# EAGLE schematic BEP32_12nutzen_stencil (EAGLE 6.4), part 1 of 4

## Sheet 1 of 12
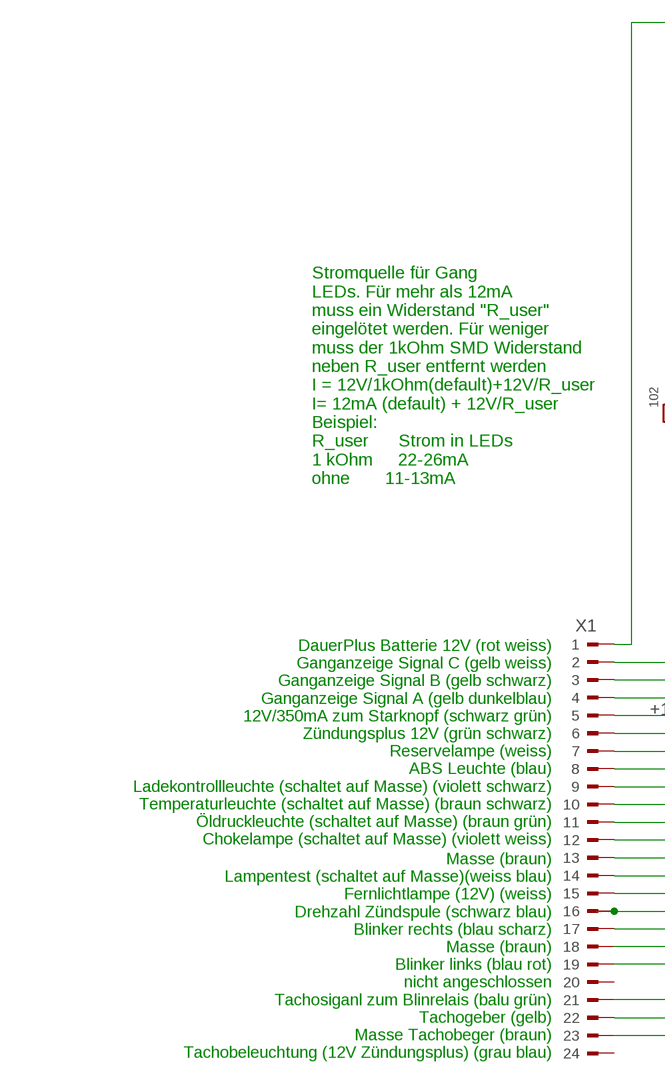
[diagram p0: schematic, sheet 1, part 1 of 2]
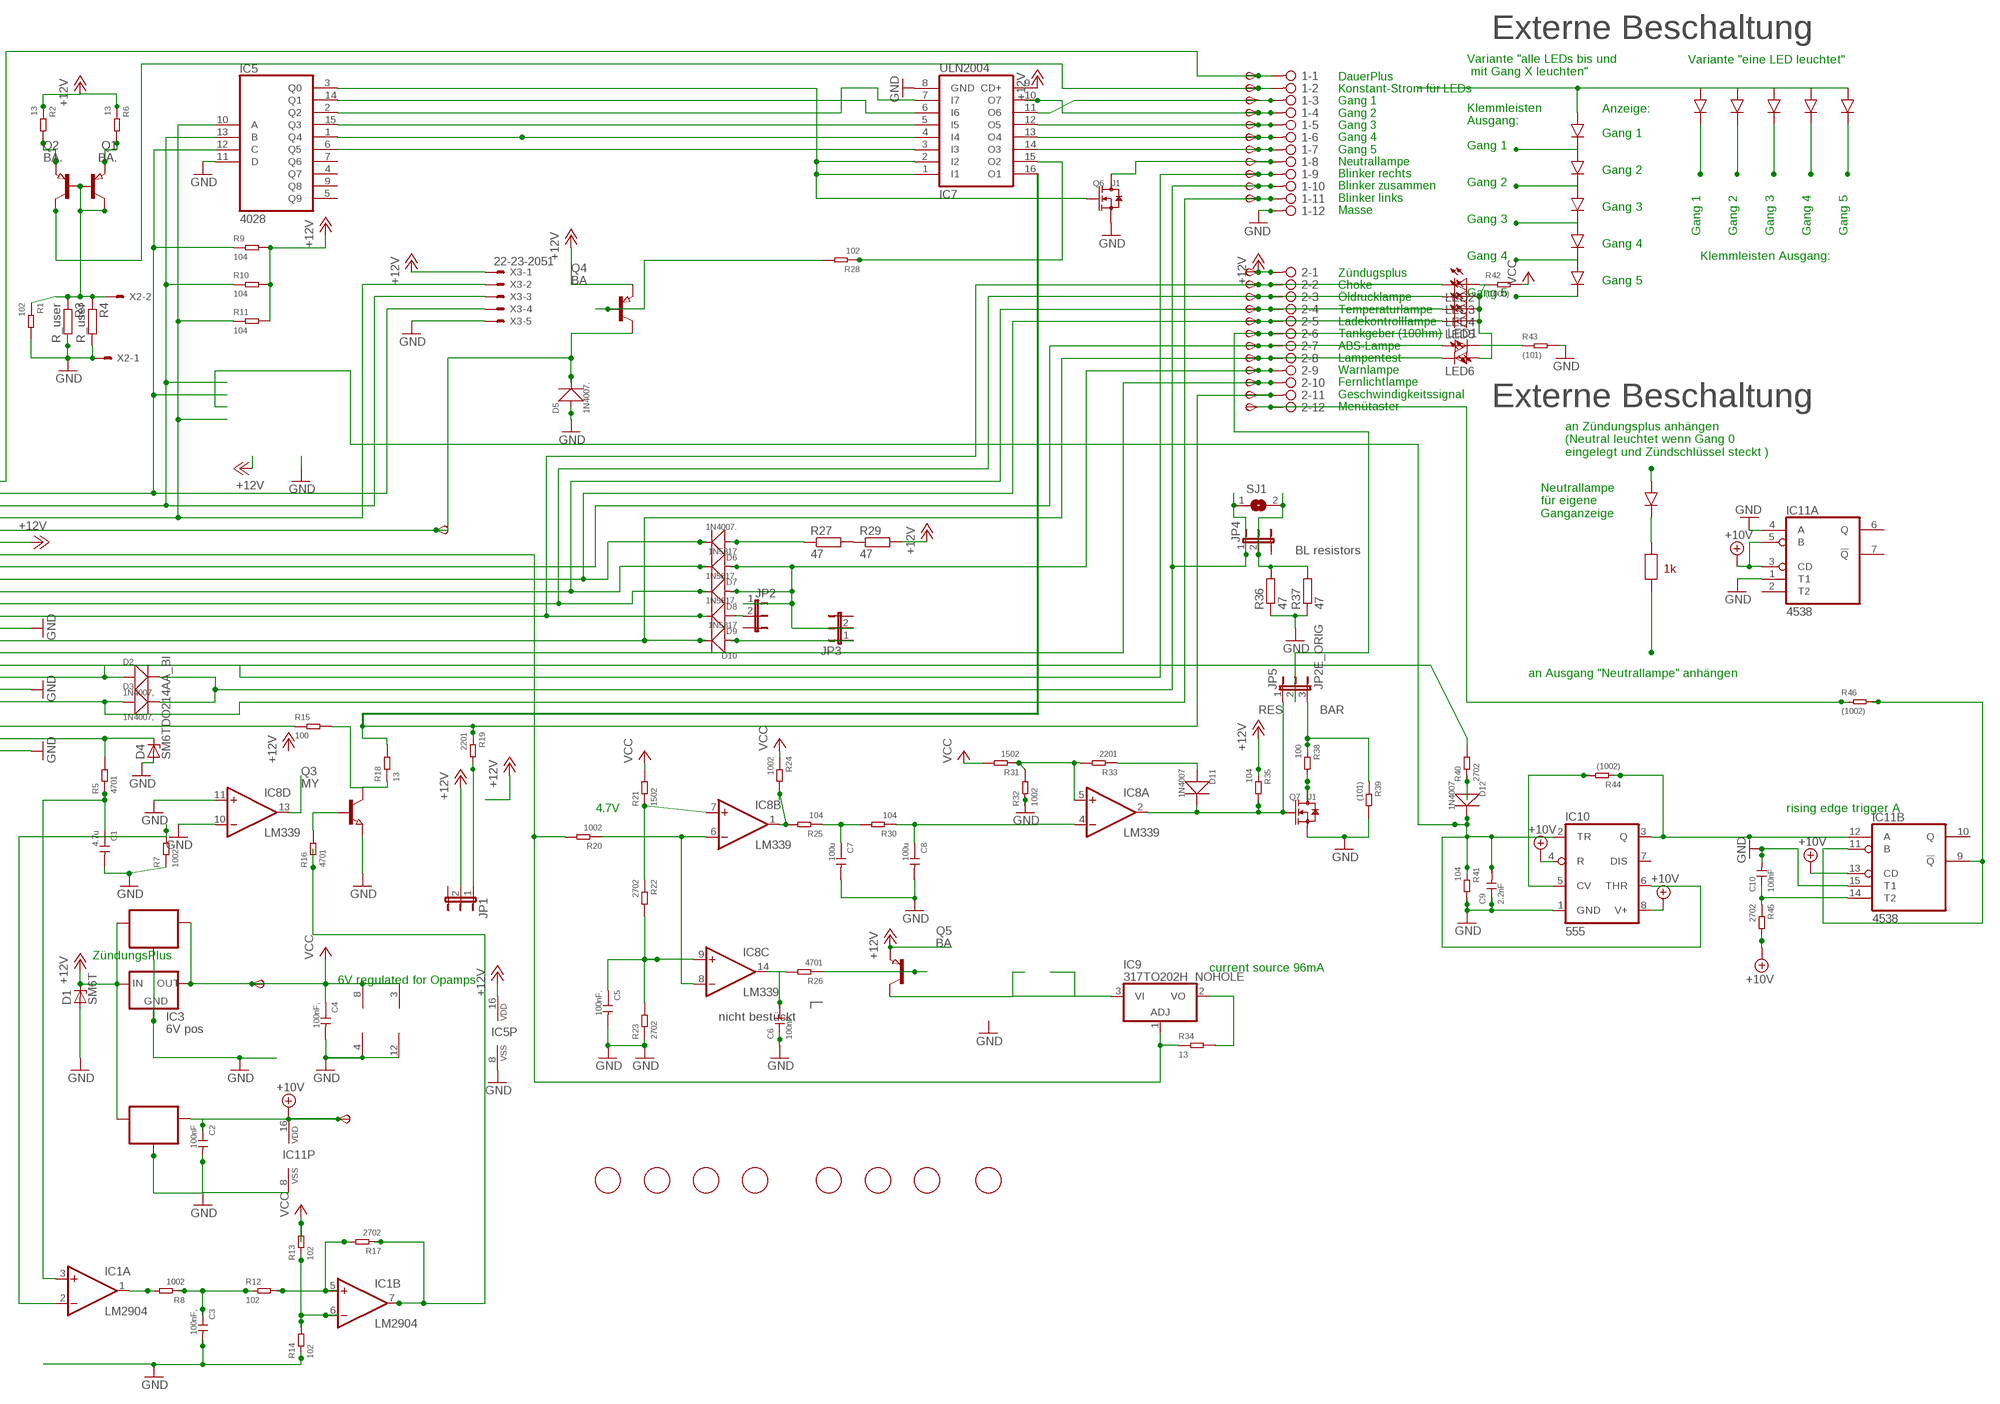
[diagram p1: schematic, sheet 1, part 2 of 2]

### Parts
1  2081-1132  [12-PIN]
2  2081-1132  [12-PIN]
6V  TPSB2.0  [B2.0]
10V  TPSB2.0  [B2.0]
C1  4.7u  CERAMIC-4.7UF-25V-10%-X5R(0805)  [C0805]
C2  100nF  CERAMIC-100NF-50V-10%-X7R(0805)  [C0805]
C3  100nF,  CERAMIC-100NF-50V-10%-X7R(0805)  [C0805]
C4  100nF,  CERAMIC-100NF-50V-10%-X7R(0805)  [C0805]
C5  100nF.  CERAMIC-100NF-50V-10%-X7R(0805)  [C0805]
C6  100nF.  CERAMIC-100NF-50V-10%-X7R(0805)  [C0805]
C7  100u  CERAMIC-100UF-6.3V-20%-X5R(1206)  [C1206]
C8  100u  CERAMIC-100UF-6.3V-20%-X5R(1206)  [C1206]
C9  2.2nF  CERAMIC-100NF-50V-10%-X7R(0805)  [C0805]
C10  100nF  CERAMIC-100NF-50V-10%-X7R(0805)  [C0805]
D1  SM6T  [DO214AA]
D2  1N4007,  DIODE-GEN-PURPOSE-1KV-1A(DO-214AC)  [DO-214AC]
D3  1N4007,  DIODE-GEN-PURPOSE-1KV-1A(DO-214AC)  [DO-214AC]
D4  SM6TDO214AA_BI  [DO214AA_BI]
D5  1N4007.  DIODE-GEN-PURPOSE-1KV-1A(DO-214AC)  [DO-214AC]
D6  1N4007.  DIODE-GEN-PURPOSE-1KV-1A(DO-214AC)  [DO-214AC]
D7  1N5817  DIODE-GEN-PURPOSE-1KV-1A(DO-214AC)DO-214AC/1206  [DO-214AC_SLIM]
D8  1N5817.  DIODE-GEN-PURPOSE-1KV-1A(DO-214AC)DO-214AC/1206  [DO-214AC_SLIM]
D9  1N5817.  DIODE-GEN-PURPOSE-1KV-1A(DO-214AC)DO-214AC/1206  [DO-214AC_SLIM]
D10  1N5817  DIODE-GEN-PURPOSE-1KV-1A(DO-214AC)DO-214AC/1206  [DO-214AC_SLIM]
D11  1N4007  DIODE-GEN-PURPOSE-1KV-1A(DO-214AC)  [DO-214AC]
D12  1N4007  DIODE-GEN-PURPOSE-1KV-1A(DO-214AC)  [DO-214AC]
FID1  FIDUCIAL  [FIDUCIAL_1MM]
FID2  FIDUCIAL  [FIDUCIAL_1MM]
FID3  FIDUCIAL  [FIDUCIAL_1MM]
FID4  FIDUCIAL  [FIDUCIAL_1MM]
FID49  FIDUCIAL  [FIDUCIAL_1MM]
FID50  FIDUCIAL  [FIDUCIAL_1MM]
FID51  FIDUCIAL  [FIDUCIAL_1MM]
FID52  FIDUCIAL  [FIDUCIAL_1MM]
IC1  LM2904  LM358D  [SO08]
IC2  78L06  78LXXSOT89_ROUND  [SOT89_ROUND]
IC3  6V pos  78LXX  [78LXX]
IC4  78L10  78LXXSOT89_ROUND  [SOT89_ROUND]
IC5  4028  4028D  [SO16]
IC7  ULN2004  ULN2004AD  [SO16]
IC8  LM339  LM339D  [SO14]
IC9  317TO202H_NOHOLE  [TO220H_NOHOLE]
IC10  555  NE555D  [SO08]
IC11  4538  4538D  [SO16]
JP1  JP2EJP2_SMALLPADS  [JP2_SMALLPADS]
JP2  JP2EJP2_SMALLPADS  [JP2_SMALLPADS]
JP3  JP2EJP2_SMALLPADS  [JP2_SMALLPADS]
JP4  JP2EJP2_SMALLPADS  [JP2_SMALLPADS]
JP5  JP2E_ORIG  [JP2_ORIG_SMALLPADS]
LED1  LEDLD260  [LD260]
LED2  LEDLD260  [LD260]
LED3  LEDLD260  [LD260]
LED4  LEDLD260  [LD260]
LED5  LEDLD260  [LD260]
LED6  LEDLD260  [LD260]
Q1  BA.  PNP-TRANSISTOR_SOT89  [SOT89]
Q2  BA.  PNP-TRANSISTOR_SOT89  [SOT89]
Q3  MY  NPN-TRANSISTOR_SOT89  [SOT89]
Q4  BA  PNP-TRANSISTOR_SOT89  [SOT89]
Q5  BA  PNP-TRANSISTOR_SOT89  [SOT89]
Q6  J1  SMD-MOSFET-N-CH-50V-200MA-BSS138W-7-F(SOT-23)  [SOT-23]
Q7  J1  SMD-MOSFET-N-CH-50V-200MA-BSS138W-7-F(SOT-23)  [SOT-23]
R1  102  SMD-RES-1K-5%-1/8W(0805)  [R0805]
R2  13  SMD-RES-13R-5%-1/4W(1206)  [R1206]
R3  R_user  R-EU_R0805  [R0805]
R4  R_user  R-EU_R0805  [R0805]
R5  4701  SMD-RES-4.7K-5%-1/8W(0805)  [R0805]
R6  13  SMD-RES-13R-5%-1/4W(1206)  [R1206]
R7  1002  SMD-RES-10K-1%-1/8W(0805)  [R0805]
R8  1002  SMD-RES-10K-1%-1/8W(0805)  [R0805]
R9  104  SMD-RES-10K-1%-1/8W(0805)  [R0805]
R10  104  SMD-RES-10K-1%-1/8W(0805)  [R0805]
R11  104  SMD-RES-10K-1%-1/8W(0805)  [R0805]
R12  102  SMD-RES-1K-5%-1/8W(0805)  [R0805]
R13  102  SMD-RES-1K-5%-1/8W(0805)  [R0805]
R14  102  SMD-RES-1K-5%-1/8W(0805)  [R0805]
R15  100  SMD-RES-220R-5%-1/8W(0805)  [R0805]
R16  4701  SMD-RES-4.7K-5%-1/8W(0805)  [R0805]
R17  2702  SMD-RES-4.7K-5%-1/8W(0805)  [R0805]
R18  13  SMD-RES-13R-5%-1/4W(1206)  [R1206]
R19  2201  SMD-RES-2.2K-5%-1/8W(0805)  [R0805]
R20  1002  SMD-RES-10K-1%-1/8W(0805)  [R0805]
R21  1502  SMD-RES-10K-1%-1/8W(0805)  [R0805]
R22  2702  SMD-RES-4.7K-5%-1/8W(0805)  [R0805]
R23  2702  SMD-RES-4.7K-5%-1/8W(0805)  [R0805]
R24  1002  SMD-RES-10K-1%-1/8W(0805)  [R0805]
R25  104  SMD-RES-10K-1%-1/8W(0805)  [R0805]
R26  4701  SMD-RES-4.7K-5%-1/8W(0805)  [R0805]
R27  47  R-EU_V235/17_1MM  [V235/17_1MM]
R28  102  SMD-RES-1K-5%-1/8W(0805)  [R0805]
R29  47  R-EU_V235/17_1MM  [V235/17_1MM]
R30  104  SMD-RES-10K-1%-1/8W(0805)  [R0805]
R31  1502  SMD-RES-10K-1%-1/8W(0805)  [R0805]
R32  1002  SMD-RES-10K-1%-1/8W(0805)  [R0805]
R33  2201  SMD-RES-2.2K-5%-1/8W(0805)  [R0805]
R34  13  SMD-RES-13R-5%-1/4W(1206)  [R1206]
R35  104  SMD-RES-10K-1%-1/8W(0805)  [R0805]
R36  47  R-EU_V235/17_1MM  [V235/17_1MM]
R37  47  R-EU_V235/17_1MM  [V235/17_1MM]
R38  100  SMD-RES-2.2K-5%-1/8W(0805)  [R0805]
R39  (101)  SMD-RES-2.2K-5%-1/8W(0805)  [R0805]
R40  2702  SMD-RES-10K-1%-1/8W(0805)  [R0805]
R41  104  SMD-RES-10K-1%-1/8W(0805)  [R0805]
R42  (1000)  SMD-RES-100R-5%-1/8W(0805)  [R0805]
R43  (101)  SMD-RES-100R-5%-1/8W(0805)  [R0805]
R44  (1002)  SMD-RES-10K-1%-1/8W(0805)  [R0805]
R45  2702  SMD-RES-4.7K-5%-1/8W(0805)  [R0805]
R46  (1002)  SMD-RES-4.7K-5%-1/8W(0805)  [R0805]
SJ1  SJ  [SJ]
START  TPSB2.0  [B2.0]
TP1  TPSB2.0  [B2.0]
TP2  TPSB2.0  [B2.0]
TP3  TPSB2.0  [B2.0]
TP4  TPSB2.0  [B2.0]
TP5  TPSB2.0  [B2.0]
TP6  TPSB2.0  [B2.0]
TP7  TPSB2.0  [B2.0]
TP8  TPSB2.0  [B2.0]
TP9  TPSB2.0  [B2.0]
TP10  TPSB2.0  [B2.0]
TP11  TPSB2.0  [B2.0]
TP12  TPSB2.0  [B2.0]
TP13  TPSB2.0  [B2.0]
TP16  TPSB2.0  [B2.0]
TP17  TPSB2.0  [B2.0]
TP18  TPSB2.0  [B2.0]
TP19  TPSB2.0  [B2.0]
TP21  TPSB2.0  [B2.0]
TP22  TPSB2.0  [B2.0]
TP23  TPSB2.0  [B2.0]
TP24  TPSB1,27  [B1,27]
TP25  TPSB2.0  [B2.0]
TP26  TPSB2.0  [B2.0]
X1  CON_BMWV2  [24-PIN_V2]
X2  22-23-2021  [22-23-2021]
X3  22-23-2051  [22-23-2051]

### Nets
+10V: 10V.TP(PP) C2.1 IC4.1(OUT) IC10.4(R) IC10.8(V+) IC11.3(A:CD) IC11.5(A:B) IC11.13(B:CD) IC11.16(P:VDD) R45.2 ; also sheet 2,3,4,5,6,7,8,9,10,11,12
+12V: 2.1 D1.C IC2.3(IN) IC3.IN IC4.3(IN) IC5.16(VDD) IC7.9(CD+) JP1.2 Q4.3(E) Q5.3(E) R2.1 R6.1 R9.2 R10.2 R11.2 R29.2 R35.1 TP12.TP(PP) X1.6 X3.1 ; also sheet 2,3,4,5,6,7,8,9,10,11,12
+12V1: IC1.7(B:OUT) R16.1 R17.1
GND: 1.12 C1.2 C2.2 C3.2 C4.2 C5.2 C6.1 C7.2 C8.2 C9.1 C10.2 D1.A D4.A D5.1(+) IC1.4(P:V-) IC2.2(GND) IC2.2@1(GND) IC3.GND IC4.2(GND) IC4.2@1(GND) IC5.8(VSS) IC5.11(D) IC7.8(GND) IC8.10(D:-IN) IC8.11(D:+IN) IC8.12(P:GND) IC10.1(GND) IC11.1(A:T1) IC11.4(A:A) IC11.8(P:VSS) IC11.15(B:T1) Q3.3(E) Q6.2(S) Q7.2(S) R1.2 R3.2 R4.2 R7.1 R14.1 R23.1 R32.1 R36.1 R37.1 R39.2 R41.2 R43.2 X1.13 X1.18 X1.23 X2.1 X3.5 ; also sheet 2,3,4,5,6,7,8,9,10,11,12
N$1: 2.9 D7.1(+) D8.1(+) JP2.1 JP3.2 TP24.TP(PP)
N$2: IC5.10(A) R11.1 X1.4 X3.2
N$3: IC5.13(B) R10.1 X1.3 X3.3
N$4: 2.7 LED1.A TP22.TP(PP) X1.8
N$5: Q1.3(E) R2.2
N$6: D11.2(-) IC8.2(A:OUT) JP5.1 Q7.1(G) R35.2
N$7: IC1.2(A:-IN) R7.2
N$8: R27.2 R29.1
N$9: Q2.3(E) R6.2
N$11: D5.2(-) Q4.2(C) START.TP(PP) X1.5
N$12: 2.2 D9.2(-) LED2.K(C) TP16.TP(PP) X1.12
N$13: 2.3 D8.2(-) LED3.K(C) TP17.TP(PP) X1.11
N$14: 2.4 D7.2(-) LED4.K(C) TP18.TP(PP) X1.10
N$15: IC9.3(VI) Q5.2(C)
N$16: IC8.6(B:-IN) IC8.8(C:-IN) R20.1
N$17: IC5.12(C) R9.1 X1.2 X3.4
N$18: IC5.15(Q3) IC7.5(I5)
N$19: 2.8 D10.2(-) LED6.K(C) TP23.TP(PP) X1.14
N$20: 1.9 D2.1(+) TP9.TP(PP) X1.17
N$21: 1.11 D3.1(+) TP11.TP(PP) X1.19
N$22: IC11.9(B:!Q) IC11.11(B:B) R46.2
N$23: D4.C R5.2 X1.22
N$24: C1.1 IC1.3(A:+IN) R5.1
N$25: 1.6 IC7.13(O4) TP6.TP(PP)
N$26: 1.7 IC7.14(O3) TP7.TP(PP)
N$27: 2.11 IC7.16(O1) R18.2 R19.1 TP26.TP(PP)
N$28: 2.6 JP5.2 TP21.TP(PP)
N$29: JP1.1 R19.2
N$30: C5.1 IC8.9(C:+IN) R22.2 R23.2
N$31: C6.2 IC8.14(C:OUT) R26.2
N$32: C9.2 D12.2(-) IC10.2(TR) IC10.6(THR) R41.1
N$34: LED1.K(C) R43.1
N$35: IC9.1(ADJ) R20.2 R34.1 X1.7
N$36: Q5.1(B) R26.1
N$37: IC5.2(Q2) IC7.7(I7)
N$38: 1.3 IC7.11(O6) TP3.TP(PP)
N$39: 1.5 IC7.12(O5) TP5.TP(PP)
N$41: LED2.A LED3.A LED4.A LED5.A LED6.A R42.1
N$42: R40.2 X1.16
N$43: Q4.1(B) R28.2
N$44: IC5.3(Q0) IC7.1(I1) IC7.2(I2) Q6.1(G)
N$45: C7.1 R25.1 R30.2
N$46: C8.1 IC8.4(A:-IN) R30.1
N$47: IC8.5(A:+IN) R31.1 R32.2 R33.2
N$48: Q7.3(D) R38.2
N$49: D11.1(+) R33.1
N$50: IC5.1(Q4) IC7.4(I4)
N$51: R15.1 X1.21
N$52: 1.8 Q6.3(D) TP8.TP(PP)
N$53: 2.10 TP25.TP(PP) X1.15
N$54: D6.1(+) R27.1
N$55: 2.5 D6.2(-) LED5.K(C) TP19.TP(PP) X1.9
N$56: IC5.14(Q1) IC7.6(I6)
N$57: Q1.1(B) Q2.1(B) Q2.2(C) R1.1 R3.1 R4.1 X2.2
N$58: Q3.2(C) R15.2 R18.1
N$59: 1.2 Q1.2(C) TP2.TP(PP)
N$60: IC8.13(D:OUT)
N$61: IC5.6(Q5) IC7.3(I3)
N$64: IC9.2(VO) R34.2
N$65: IC10.5(CV) R44.2
N$67: 1.4 IC7.10(O7) TP4.TP(PP)
N$69: 1.1 TP1.TP(PP) X1.1
N$83: IC8.7(B:+IN) R21.1 R22.1
N$85: Q3.1(B) R16.2
N$86: IC10.3(Q) IC11.12(B:A) R44.1
N$87: D12.1(+) R40.1
N$88: IC7.15(O2) R28.1
N$89: C10.1 IC11.14(B:T2) R45.1
N$90: 2.12 R46.1 TP13.TP(PP)
N$92: IC1.1(A:OUT) R8.2
N$93: 1.10 D2.2(-) D3.2(-) JP4.1 SJ1.1 TP10.TP(PP)
N$94: JP4.2 R36.2 R37.2 SJ1.2
N$95: D9.1(+) JP2.2
N$96: C3.1 R8.1 R12.1
N$97: IC1.5(B:+IN) R12.2 R17.2
N$98: D10.1(+) JP3.1
N$99: JP5.3 R38.1 R39.1
N$101: IC1.6(B:-IN) R13.1 R14.2
N$580: IC8.1(B:OUT) R24.2 R25.2
VCC: 6V.TP(PP) C4.1 IC1.8(P:V+) IC2.1(OUT) IC3.OUT IC8.3(P:V+) R13.2 R21.2 R24.1 R31.2 R42.2 ; also sheet 2,3,4,5,6,7,8,9,10,11,12
Unconnected: IC5.4(Q7) IC5.5(Q9) IC5.7(Q6) IC5.9(Q8) IC10.7(DIS) IC11.2(A:T2) IC11.6(A:Q) IC11.7(A:!Q) IC11.10(B:Q) X1.20 X1.24

### Notes on the sheet
- Externe Beschaltung
- Variante "eine LED leuchtet"
- Variante "alle LEDs bis und
   mit Gang X leuchten"
- Anzeige:
- Klemmleisten
  Ausgang:
- Gang 1
- DauerPlus
  Konstant-Strom für LEDs
  Gang 1
  Gang 2
  Gang 3
  Gang 4
  Gang 5
  Neutrallampe
  Blinker rechts
  Blinker zusammen
  Blinker links
  Masse
- Gang 1
- Gang 2
- Gang 2
- Gang 3
- Gang 3
- Gang 1 | Gang 2 | Gang 3 | Gang 4 | Gang 5
- Gang 4
- Gang 4 | Klemmleisten Ausgang:
- Gang 5
- Gang 5
- Zündugsplus
  Choke
  Öldrucklampe
  Temperaturlampe
  Ladekontrolllampe
  Tankgeber (100hm)
  ABS-Lampe
  Lampentest
  Warnlampe
  Fernlichtlampe
  Geschwindigkeitssignal
  Menütaster
- Stromquelle für Gang
  LEDs. Für mehr als 12mA
  muss ein Widerstand "R_user"
  eingelötet werden. Für weniger
  muss der 1kOhm SMD Widerstand
  neben R_user entfernt werden
  I = 12V/1kOhm(default)+12V/R_user
  I= 12mA (default) + 12V/R_user
  Beispiel:
  R_user      Strom in LEDs
  1 kOhm     22-26mA
  ohne       11-13mA
- Externe Beschaltung
- an Zündungsplus anhängen
  (Neutral leuchtet wenn Gang 0
  eingelegt und Zündschlüssel steckt )
- Neutrallampe
  für eigene
  Ganganzeige
- DauerPlus Batterie 12V (rot weiss)
  Ganganzeige Signal C (gelb weiss)
  Ganganzeige Signal B (gelb schwarz)
  Ganganzeige Signal A (gelb dunkelblau)
  12V/350mA zum Starknopf (schwarz grün)
  Zündungsplus 12V (grün schwarz)
  Reservelampe (weiss)
  ABS Leuchte (blau)
  Ladekontrollleuchte (schaltet auf Masse) (violett schwarz)
  Temperaturleuchte (schaltet auf Masse) (braun schwarz)
  Öldruckleuchte (schaltet auf Masse) (braun grün)
  Chokelampe (schaltet auf Masse) (violett weiss)
- BL resistors
- 1k
- an Ausgang "Neutrallampe" anhängen
- Masse (braun)
  Lampentest (schaltet auf Masse)(weiss blau)
  Fernlichtlampe (12V) (weiss)
  Drehzahl Zündspule (schwarz blau)
  Blinker rechts (blau scharz)
  Masse (braun)
  Blinker links (blau rot)
  nicht angeschlossen
  Tachosiganl zum Blinrelais (balu grün)
  Tachogeber (gelb)
  Masse Tachobeger (braun)
  Tachobeleuchtung (12V Zündungsplus) (grau blau)
- RES | BAR
- 4.7V | rising edge trigger A
- ZündungsPlus
- current source 96mA
- 6V regulated for Opamps
- nicht bestückt

## Sheet 2 of 12
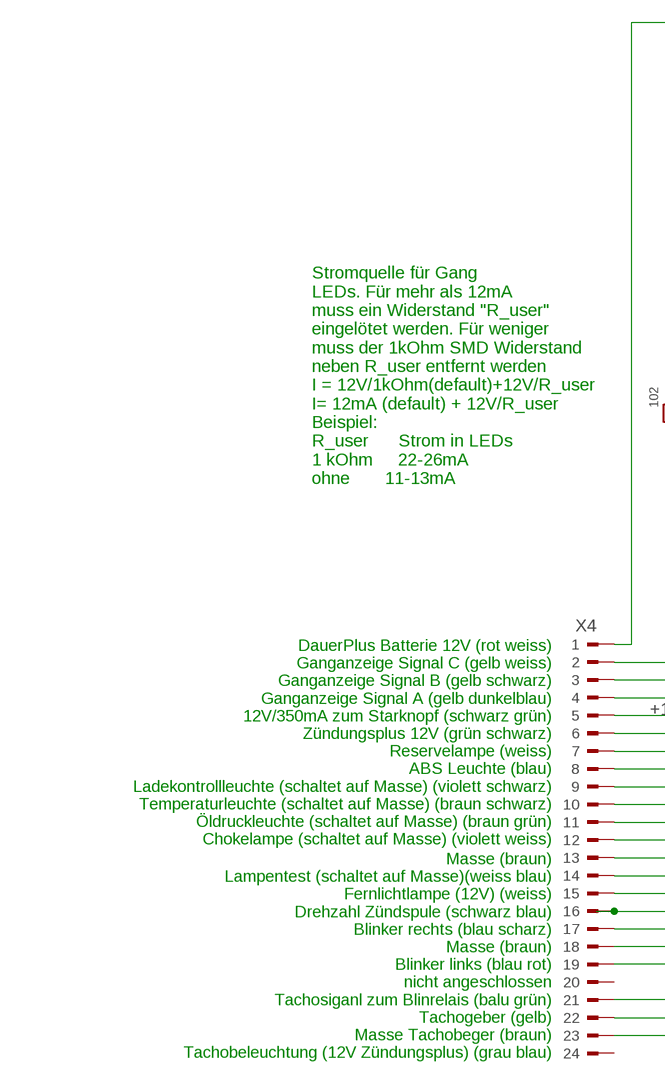
[diagram p2: schematic, sheet 2, part 1 of 2]
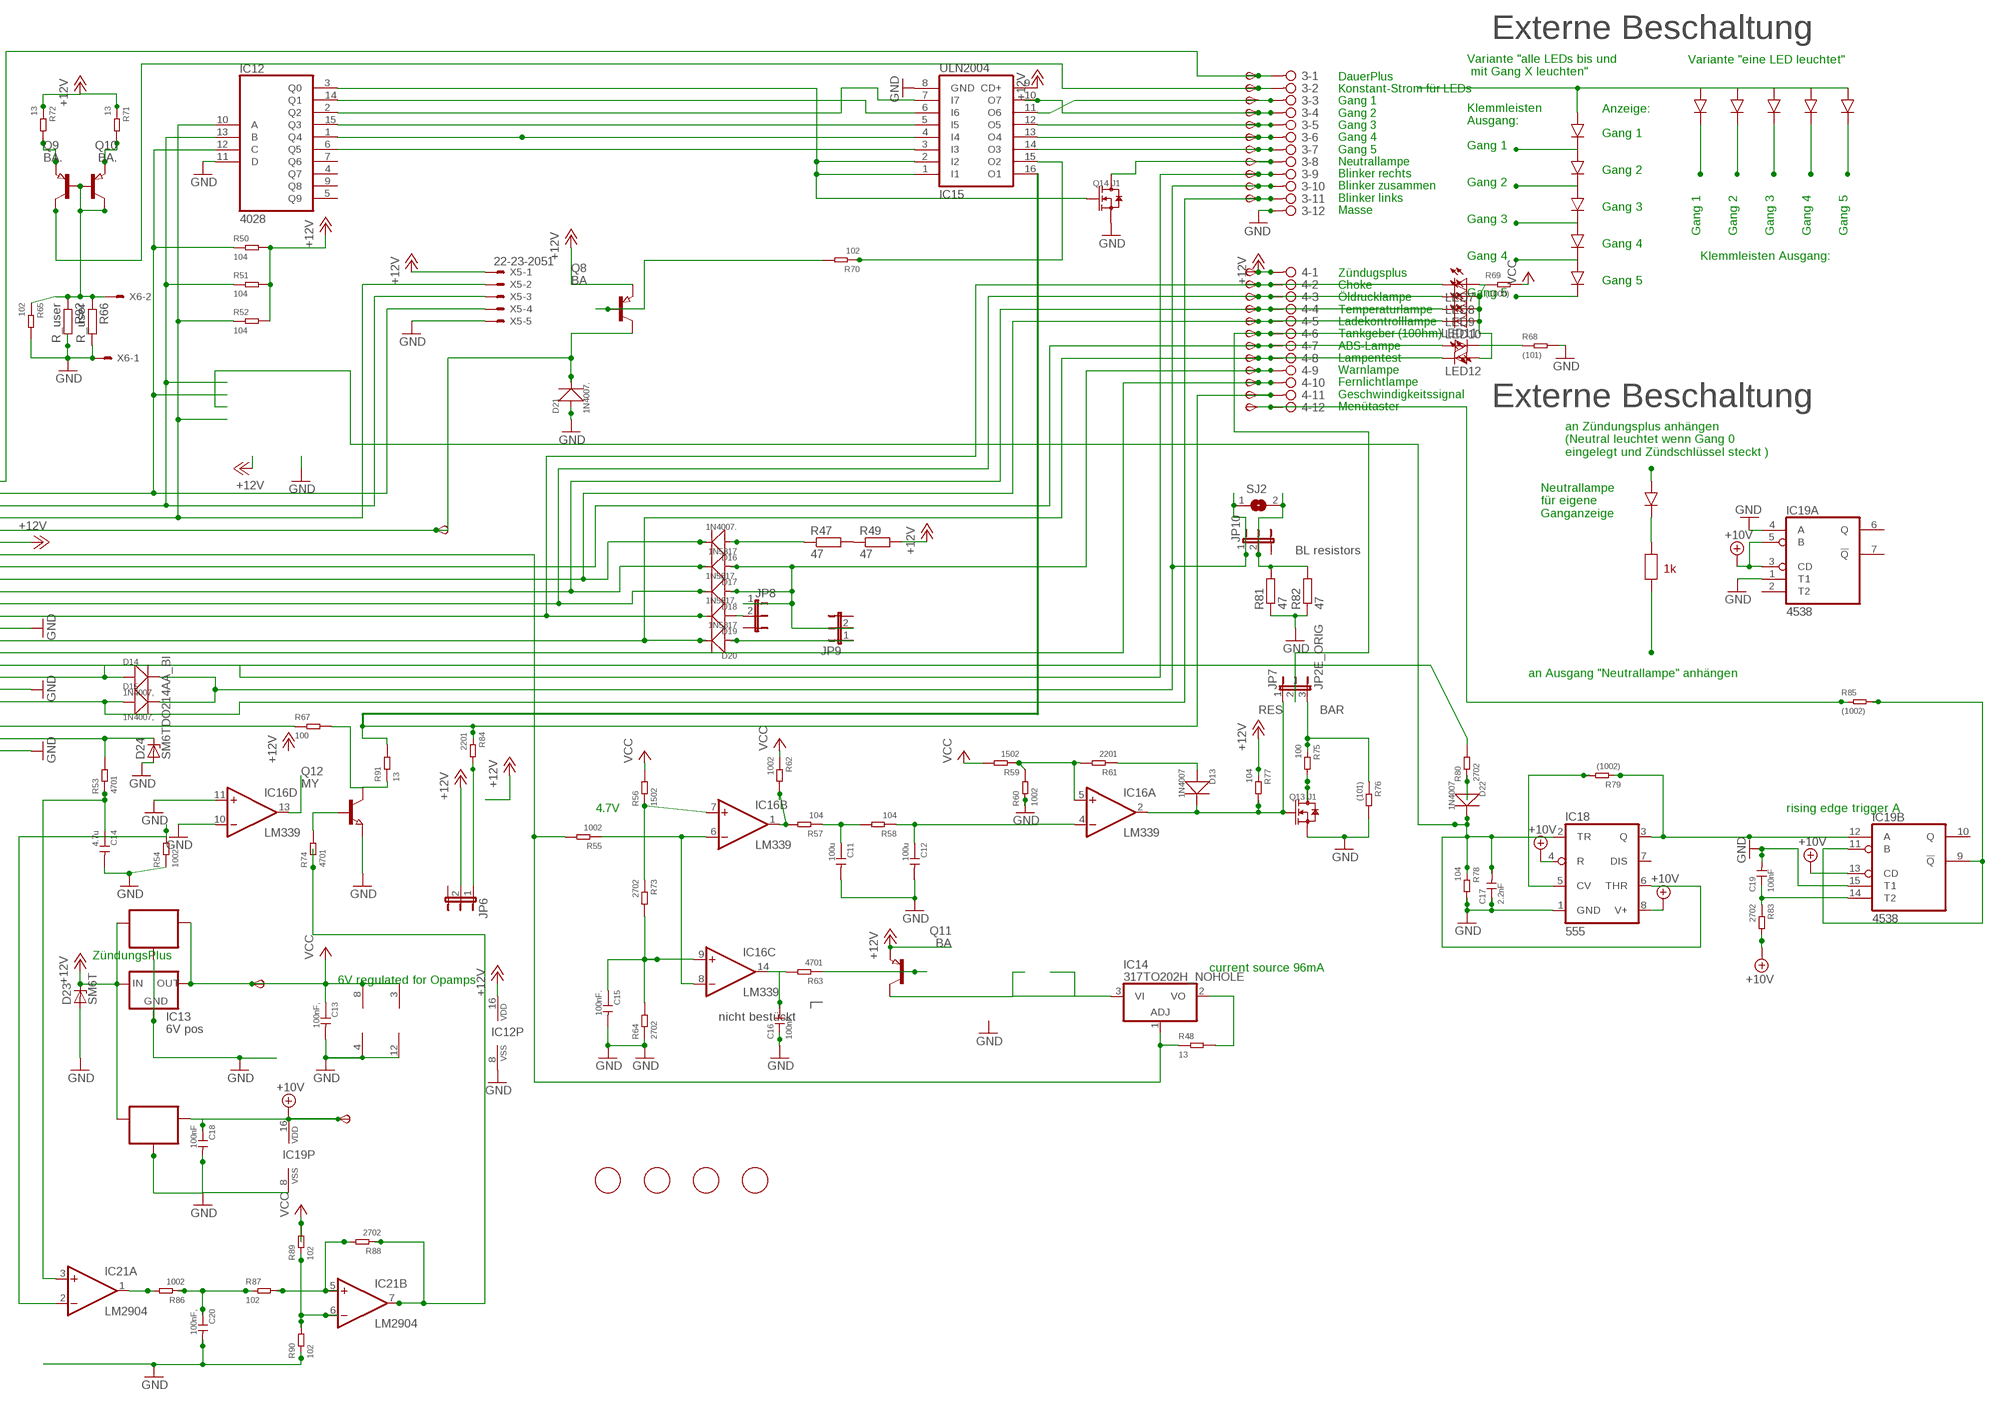
[diagram p3: schematic, sheet 2, part 2 of 2]

### Parts
3  2081-1132  [12-PIN]
4  2081-1132  [12-PIN]
6V1  TPSB2.0  [B2.0]
10V1  TPSB2.0  [B2.0]
C11  100u  CERAMIC-100UF-6.3V-20%-X5R(1206)  [C1206]
C12  100u  CERAMIC-100UF-6.3V-20%-X5R(1206)  [C1206]
C13  100nF,  CERAMIC-100NF-50V-10%-X7R(0805)  [C0805]
C14  4.7u  CERAMIC-4.7UF-25V-10%-X5R(0805)  [C0805]
C15  100nF.  CERAMIC-100NF-50V-10%-X7R(0805)  [C0805]
C16  100nF.  CERAMIC-100NF-50V-10%-X7R(0805)  [C0805]
C17  2.2nF  CERAMIC-100NF-50V-10%-X7R(0805)  [C0805]
C18  100nF  CERAMIC-100NF-50V-10%-X7R(0805)  [C0805]
C19  100nF  CERAMIC-100NF-50V-10%-X7R(0805)  [C0805]
C20  100nF,  CERAMIC-100NF-50V-10%-X7R(0805)  [C0805]
D13  1N4007  DIODE-GEN-PURPOSE-1KV-1A(DO-214AC)  [DO-214AC]
D14  1N4007,  DIODE-GEN-PURPOSE-1KV-1A(DO-214AC)  [DO-214AC]
D15  1N4007,  DIODE-GEN-PURPOSE-1KV-1A(DO-214AC)  [DO-214AC]
D16  1N4007.  DIODE-GEN-PURPOSE-1KV-1A(DO-214AC)  [DO-214AC]
D17  1N5817  DIODE-GEN-PURPOSE-1KV-1A(DO-214AC)DO-214AC/1206  [DO-214AC_SLIM]
D18  1N5817.  DIODE-GEN-PURPOSE-1KV-1A(DO-214AC)DO-214AC/1206  [DO-214AC_SLIM]
D19  1N5817.  DIODE-GEN-PURPOSE-1KV-1A(DO-214AC)DO-214AC/1206  [DO-214AC_SLIM]
D20  1N5817  DIODE-GEN-PURPOSE-1KV-1A(DO-214AC)DO-214AC/1206  [DO-214AC_SLIM]
D21  1N4007.  DIODE-GEN-PURPOSE-1KV-1A(DO-214AC)  [DO-214AC]
D22  1N4007  DIODE-GEN-PURPOSE-1KV-1A(DO-214AC)  [DO-214AC]
D23  SM6T  [DO214AA]
D24  SM6TDO214AA_BI  [DO214AA_BI]
FID5  FIDUCIAL  [FIDUCIAL_1MM]
FID6  FIDUCIAL  [FIDUCIAL_1MM]
FID7  FIDUCIAL  [FIDUCIAL_1MM]
FID8  FIDUCIAL  [FIDUCIAL_1MM]
IC12  4028  4028D  [SO16]
IC13  6V pos  78LXX  [78LXX]
IC14  317TO202H_NOHOLE  [TO220H_NOHOLE]
IC15  ULN2004  ULN2004AD  [SO16]
IC16  LM339  LM339D  [SO14]
IC17  78L06  78LXXSOT89_ROUND  [SOT89_ROUND]
IC18  555  NE555D  [SO08]
IC19  4538  4538D  [SO16]
IC20  78L10  78LXXSOT89_ROUND  [SOT89_ROUND]
IC21  LM2904  LM358D  [SO08]
JP6  JP2EJP2_SMALLPADS  [JP2_SMALLPADS]
JP7  JP2E_ORIG  [JP2_ORIG_SMALLPADS]
JP8  JP2EJP2_SMALLPADS  [JP2_SMALLPADS]
JP9  JP2EJP2_SMALLPADS  [JP2_SMALLPADS]
JP10  JP2EJP2_SMALLPADS  [JP2_SMALLPADS]
LED7  LEDLD260  [LD260]
LED8  LEDLD260  [LD260]
LED9  LEDLD260  [LD260]
LED10  LEDLD260  [LD260]
LED11  LEDLD260  [LD260]
LED12  LEDLD260  [LD260]
Q8  BA  PNP-TRANSISTOR_SOT89  [SOT89]
Q9  BA.  PNP-TRANSISTOR_SOT89  [SOT89]
Q10  BA.  PNP-TRANSISTOR_SOT89  [SOT89]
Q11  BA  PNP-TRANSISTOR_SOT89  [SOT89]
Q12  MY  NPN-TRANSISTOR_SOT89  [SOT89]
Q13  J1  SMD-MOSFET-N-CH-50V-200MA-BSS138W-7-F(SOT-23)  [SOT-23]
Q14  J1  SMD-MOSFET-N-CH-50V-200MA-BSS138W-7-F(SOT-23)  [SOT-23]
R47  47  R-EU_V235/17_1MM  [V235/17_1MM]
R48  13  SMD-RES-13R-5%-1/4W(1206)  [R1206]
R49  47  R-EU_V235/17_1MM  [V235/17_1MM]
R50  104  SMD-RES-10K-1%-1/8W(0805)  [R0805]
R51  104  SMD-RES-10K-1%-1/8W(0805)  [R0805]
R52  104  SMD-RES-10K-1%-1/8W(0805)  [R0805]
R53  4701  SMD-RES-4.7K-5%-1/8W(0805)  [R0805]
R54  1002  SMD-RES-10K-1%-1/8W(0805)  [R0805]
R55  1002  SMD-RES-10K-1%-1/8W(0805)  [R0805]
R56  1502  SMD-RES-10K-1%-1/8W(0805)  [R0805]
R57  104  SMD-RES-10K-1%-1/8W(0805)  [R0805]
R58  104  SMD-RES-10K-1%-1/8W(0805)  [R0805]
R59  1502  SMD-RES-10K-1%-1/8W(0805)  [R0805]
R60  1002  SMD-RES-10K-1%-1/8W(0805)  [R0805]
R61  2201  SMD-RES-2.2K-5%-1/8W(0805)  [R0805]
R62  1002  SMD-RES-10K-1%-1/8W(0805)  [R0805]
R63  4701  SMD-RES-4.7K-5%-1/8W(0805)  [R0805]
R64  2702  SMD-RES-4.7K-5%-1/8W(0805)  [R0805]
R65  102  SMD-RES-1K-5%-1/8W(0805)  [R0805]
R66  R_user  R-EU_R0805  [R0805]
R67  100  SMD-RES-220R-5%-1/8W(0805)  [R0805]
R68  (101)  SMD-RES-100R-5%-1/8W(0805)  [R0805]
R69  (1000)  SMD-RES-100R-5%-1/8W(0805)  [R0805]
R70  102  SMD-RES-1K-5%-1/8W(0805)  [R0805]
R71  13  SMD-RES-13R-5%-1/4W(1206)  [R1206]
R72  13  SMD-RES-13R-5%-1/4W(1206)  [R1206]
R73  2702  SMD-RES-4.7K-5%-1/8W(0805)  [R0805]
R74  4701  SMD-RES-4.7K-5%-1/8W(0805)  [R0805]
R75  100  SMD-RES-2.2K-5%-1/8W(0805)  [R0805]
R76  (101)  SMD-RES-2.2K-5%-1/8W(0805)  [R0805]
R77  104  SMD-RES-10K-1%-1/8W(0805)  [R0805]
R78  104  SMD-RES-10K-1%-1/8W(0805)  [R0805]
R79  (1002)  SMD-RES-10K-1%-1/8W(0805)  [R0805]
R80  2702  SMD-RES-10K-1%-1/8W(0805)  [R0805]
R81  47  R-EU_V235/17_1MM  [V235/17_1MM]
R82  47  R-EU_V235/17_1MM  [V235/17_1MM]
R83  2702  SMD-RES-4.7K-5%-1/8W(0805)  [R0805]
R84  2201  SMD-RES-2.2K-5%-1/8W(0805)  [R0805]
R85  (1002)  SMD-RES-4.7K-5%-1/8W(0805)  [R0805]
R86  1002  SMD-RES-10K-1%-1/8W(0805)  [R0805]
R87  102  SMD-RES-1K-5%-1/8W(0805)  [R0805]
R88  2702  SMD-RES-4.7K-5%-1/8W(0805)  [R0805]
R89  102  SMD-RES-1K-5%-1/8W(0805)  [R0805]
R90  102  SMD-RES-1K-5%-1/8W(0805)  [R0805]
R91  13  SMD-RES-13R-5%-1/4W(1206)  [R1206]
R92  R_user  R-EU_R0805  [R0805]
SJ2  SJ  [SJ]
START1  TPSB2.0  [B2.0]
TP14  TPSB2.0  [B2.0]
TP15  TPSB2.0  [B2.0]
TP20  TPSB2.0  [B2.0]
TP27  TPSB2.0  [B2.0]
TP28  TPSB2.0  [B2.0]
TP29  TPSB2.0  [B2.0]
TP30  TPSB2.0  [B2.0]
TP31  TPSB2.0  [B2.0]
TP32  TPSB2.0  [B2.0]
TP33  TPSB2.0  [B2.0]
TP34  TPSB2.0  [B2.0]
TP35  TPSB2.0  [B2.0]
TP36  TPSB2.0  [B2.0]
TP37  TPSB2.0  [B2.0]
TP38  TPSB2.0  [B2.0]
TP39  TPSB2.0  [B2.0]
TP40  TPSB2.0  [B2.0]
TP41  TPSB2.0  [B2.0]
TP42  TPSB1,27  [B1,27]
TP43  TPSB2.0  [B2.0]
TP44  TPSB2.0  [B2.0]
TP45  TPSB2.0  [B2.0]
TP46  TPSB2.0  [B2.0]
X4  CON_BMWV2  [24-PIN_V2]
X5  22-23-2051  [22-23-2051]
X6  22-23-2021  [22-23-2021]

### Nets
+10V: 10V1.TP(PP) C18.1 IC18.4(R) IC18.8(V+) IC19.3(A:CD) IC19.5(A:B) IC19.13(B:CD) IC19.16(P:VDD) IC20.1(OUT) R83.2 ; also sheet 1,3,4,5,6,7,8,9,10,11,12
+12V: 4.1 D23.C IC12.16(VDD) IC13.IN IC15.9(CD+) IC17.3(IN) IC20.3(IN) JP6.2 Q8.3(E) Q11.3(E) R49.2 R50.2 R51.2 R52.2 R71.1 R72.1 R77.1 TP45.TP(PP) X4.6 X5.1 ; also sheet 1,3,4,5,6,7,8,9,10,11,12
+12V2: IC21.7(B:OUT) R74.1 R88.1
GND: 3.12 C11.2 C12.2 C13.2 C14.2 C15.2 C16.1 C17.1 C18.2 C19.2 C20.2 D21.1(+) D23.A D24.A IC12.8(VSS) IC12.11(D) IC13.GND IC15.8(GND) IC16.10(D:-IN) IC16.11(D:+IN) IC16.12(P:GND) IC17.2(GND) IC17.2@1(GND) IC18.1(GND) IC19.1(A:T1) IC19.4(A:A) IC19.8(P:VSS) IC19.15(B:T1) IC20.2(GND) IC20.2@1(GND) IC21.4(P:V-) Q12.3(E) Q13.2(S) Q14.2(S) R54.1 R60.1 R64.1 R65.2 R66.2 R68.2 R76.2 R78.2 R81.1 R82.1 R90.1 R92.2 X4.13 X4.18 X4.23 X5.5 X6.1 ; also sheet 1,3,4,5,6,7,8,9,10,11,12
N$84: R47.2 R49.1
N$91: 4.9 D17.1(+) D18.1(+) JP8.1 JP9.2 TP42.TP(PP)
N$100: IC12.10(A) R52.1 X4.4 X5.2
N$102: IC12.13(B) R51.1 X4.3 X5.3
N$103: D21.2(-) Q8.2(C) START1.TP(PP) X4.5
N$104: IC12.12(C) R50.1 X4.2 X5.4
N$105: 4.7 LED11.A TP40.TP(PP) X4.8
N$106: 4.2 D19.2(-) LED7.K(C) TP35.TP(PP) X4.12
N$107: 4.3 D18.2(-) LED8.K(C) TP36.TP(PP) X4.11
N$108: 4.4 D17.2(-) LED9.K(C) TP37.TP(PP) X4.10
N$109: 4.8 D20.2(-) LED12.K(C) TP41.TP(PP) X4.14
N$110: 3.9 D14.1(+) TP32.TP(PP) X4.17
N$111: 3.11 D15.1(+) TP34.TP(PP) X4.19
N$112: D24.C R53.2 X4.22
N$113: C14.1 IC21.3(A:+IN) R53.1
N$114: 4.11 IC15.16(O1) R84.1 R91.2 TP44.TP(PP)
N$115: IC16.1(B:OUT) R57.2 R62.2
N$116: C11.1 R57.1 R58.2
N$117: C12.1 IC16.4(A:-IN) R58.1
N$118: IC16.5(A:+IN) R59.1 R60.2 R61.2
N$119: D13.1(+) R61.1
N$120: C15.1 IC16.9(C:+IN) R64.2 R73.2
N$121: C16.2 IC16.14(C:OUT) R63.2
N$122: Q11.1(B) R63.1
N$123: IC12.2(Q2) IC15.7(I7)
N$124: 3.5 IC15.12(O5) TP28.TP(PP)
N$125: IC12.1(Q4) IC15.4(I4)
N$126: 3.8 Q14.3(D) TP31.TP(PP)
N$127: 4.10 TP43.TP(PP) X4.15
N$128: 4.5 D16.2(-) LED10.K(C) TP38.TP(PP) X4.9
N$129: D16.1(+) R47.1
N$130: IC12.6(Q5) IC15.3(I3)
N$131: 3.4 IC15.10(O7) TP27.TP(PP)
N$132: IC14.1(ADJ) R48.1 R55.2 X4.7
N$133: IC16.6(B:-IN) IC16.8(C:-IN) R55.1
N$134: 3.2 Q10.2(C) TP15.TP(PP)
N$135: 3.1 TP14.TP(PP) X4.1
N$149: R80.2 X4.16
N$150: IC12.15(Q3) IC15.5(I5)
N$151: 3.6 IC15.13(O4) TP29.TP(PP)
N$152: 3.7 IC15.14(O3) TP30.TP(PP)
N$153: 4.6 JP7.2 TP39.TP(PP)
N$154: LED11.K(C) R68.1
N$155: LED7.A LED8.A LED9.A LED10.A LED12.A R69.1
N$156: Q8.1(B) R70.2
N$157: IC12.3(Q0) IC15.1(I1) IC15.2(I2) Q14.1(G)
N$158: IC12.14(Q1) IC15.6(I6)
N$159: 3.3 IC15.11(O6) TP20.TP(PP)
N$160: Q9.1(B) Q9.2(C) Q10.1(B) R65.1 R66.1 R92.1 X6.2
N$161: Q10.3(E) R72.2
N$162: Q9.3(E) R71.2
N$163: IC16.7(B:+IN) R56.1 R73.1
N$164: IC21.2(A:-IN) R54.2
N$165: Q12.1(B) R74.2
N$166: Q13.3(D) R75.2
N$167: IC14.2(VO) R48.2
N$168: IC14.3(VI) Q11.2(C)
N$169: C17.2 D22.2(-) IC18.2(TR) IC18.6(THR) R78.1
N$170: IC18.5(CV) R79.2
N$171: IC18.3(Q) IC19.12(B:A) R79.1
N$172: D22.1(+) R80.1
N$173: 3.10 D14.2(-) D15.2(-) JP10.1 SJ2.1 TP33.TP(PP)
N$174: JP10.2 R81.2 R82.2 SJ2.2
N$175: IC19.9(B:!Q) IC19.11(B:B) R85.2
N$176: C19.1 IC19.14(B:T2) R83.1
N$177: JP6.1 R84.2
N$178: IC15.15(O2) R70.1
N$179: 4.12 R85.1 TP46.TP(PP)
N$180: D19.1(+) JP8.2
N$181: D13.2(-) IC16.2(A:OUT) JP7.1 Q13.1(G) R77.2
N$182: IC21.1(A:OUT) R86.2
N$183: C20.1 R86.1 R87.1
N$184: IC21.5(B:+IN) R87.2 R88.2
N$185: IC21.6(B:-IN) R89.1 R90.2
N$186: D20.1(+) JP9.1
N$187: JP7.3 R75.1 R76.1
N$188: IC16.13(D:OUT)
N$189: R67.1 X4.21
N$190: Q12.2(C) R67.2 R91.1
VCC: 6V1.TP(PP) C13.1 IC13.OUT IC16.3(P:V+) IC17.1(OUT) IC21.8(P:V+) R56.2 R59.2 R62.1 R69.2 R89.2 ; also sheet 1,3,4,5,6,7,8,9,10,11,12
Unconnected: IC12.4(Q7) IC12.5(Q9) IC12.7(Q6) IC12.9(Q8) IC18.7(DIS) IC19.2(A:T2) IC19.6(A:Q) IC19.7(A:!Q) IC19.10(B:Q) X4.20 X4.24

### Notes on the sheet
- Externe Beschaltung
- Variante "eine LED leuchtet"
- Variante "alle LEDs bis und
   mit Gang X leuchten"
- Anzeige:
- Klemmleisten
  Ausgang:
- Gang 1
- DauerPlus
  Konstant-Strom für LEDs
  Gang 1
  Gang 2
  Gang 3
  Gang 4
  Gang 5
  Neutrallampe
  Blinker rechts
  Blinker zusammen
  Blinker links
  Masse
- Gang 1
- Gang 2
- Gang 2
- Gang 3
- Gang 3
- Gang 1 | Gang 2 | Gang 3 | Gang 4 | Gang 5
- Gang 4
- Gang 4 | Klemmleisten Ausgang:
- Gang 5
- Gang 5
- Zündugsplus
  Choke
  Öldrucklampe
  Temperaturlampe
  Ladekontrolllampe
  Tankgeber (100hm)
  ABS-Lampe
  Lampentest
  Warnlampe
  Fernlichtlampe
  Geschwindigkeitssignal
  Menütaster
- Stromquelle für Gang
  LEDs. Für mehr als 12mA
  muss ein Widerstand "R_user"
  eingelötet werden. Für weniger
  muss der 1kOhm SMD Widerstand
  neben R_user entfernt werden
  I = 12V/1kOhm(default)+12V/R_user
  I= 12mA (default) + 12V/R_user
  Beispiel:
  R_user      Strom in LEDs
  1 kOhm     22-26mA
  ohne       11-13mA
- Externe Beschaltung
- an Zündungsplus anhängen
  (Neutral leuchtet wenn Gang 0
  eingelegt und Zündschlüssel steckt )
- Neutrallampe
  für eigene
  Ganganzeige
- DauerPlus Batterie 12V (rot weiss)
  Ganganzeige Signal C (gelb weiss)
  Ganganzeige Signal B (gelb schwarz)
  Ganganzeige Signal A (gelb dunkelblau)
  12V/350mA zum Starknopf (schwarz grün)
  Zündungsplus 12V (grün schwarz)
  Reservelampe (weiss)
  ABS Leuchte (blau)
  Ladekontrollleuchte (schaltet auf Masse) (violett schwarz)
  Temperaturleuchte (schaltet auf Masse) (braun schwarz)
  Öldruckleuchte (schaltet auf Masse) (braun grün)
  Chokelampe (schaltet auf Masse) (violett weiss)
- BL resistors
- 1k
- an Ausgang "Neutrallampe" anhängen
- Masse (braun)
  Lampentest (schaltet auf Masse)(weiss blau)
  Fernlichtlampe (12V) (weiss)
  Drehzahl Zündspule (schwarz blau)
  Blinker rechts (blau scharz)
  Masse (braun)
  Blinker links (blau rot)
  nicht angeschlossen
  Tachosiganl zum Blinrelais (balu grün)
  Tachogeber (gelb)
  Masse Tachobeger (braun)
  Tachobeleuchtung (12V Zündungsplus) (grau blau)
- RES | BAR
- 4.7V | rising edge trigger A
- ZündungsPlus
- current source 96mA
- 6V regulated for Opamps
- nicht bestückt

## Sheet 3 of 12
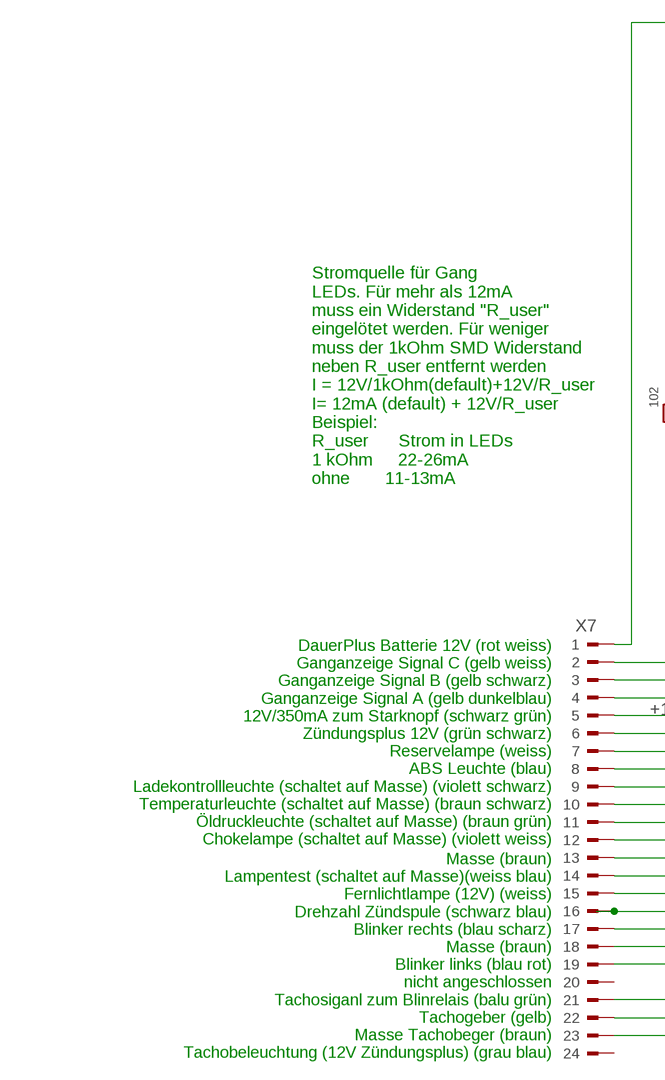
[diagram p4: schematic, sheet 3, part 1 of 2]
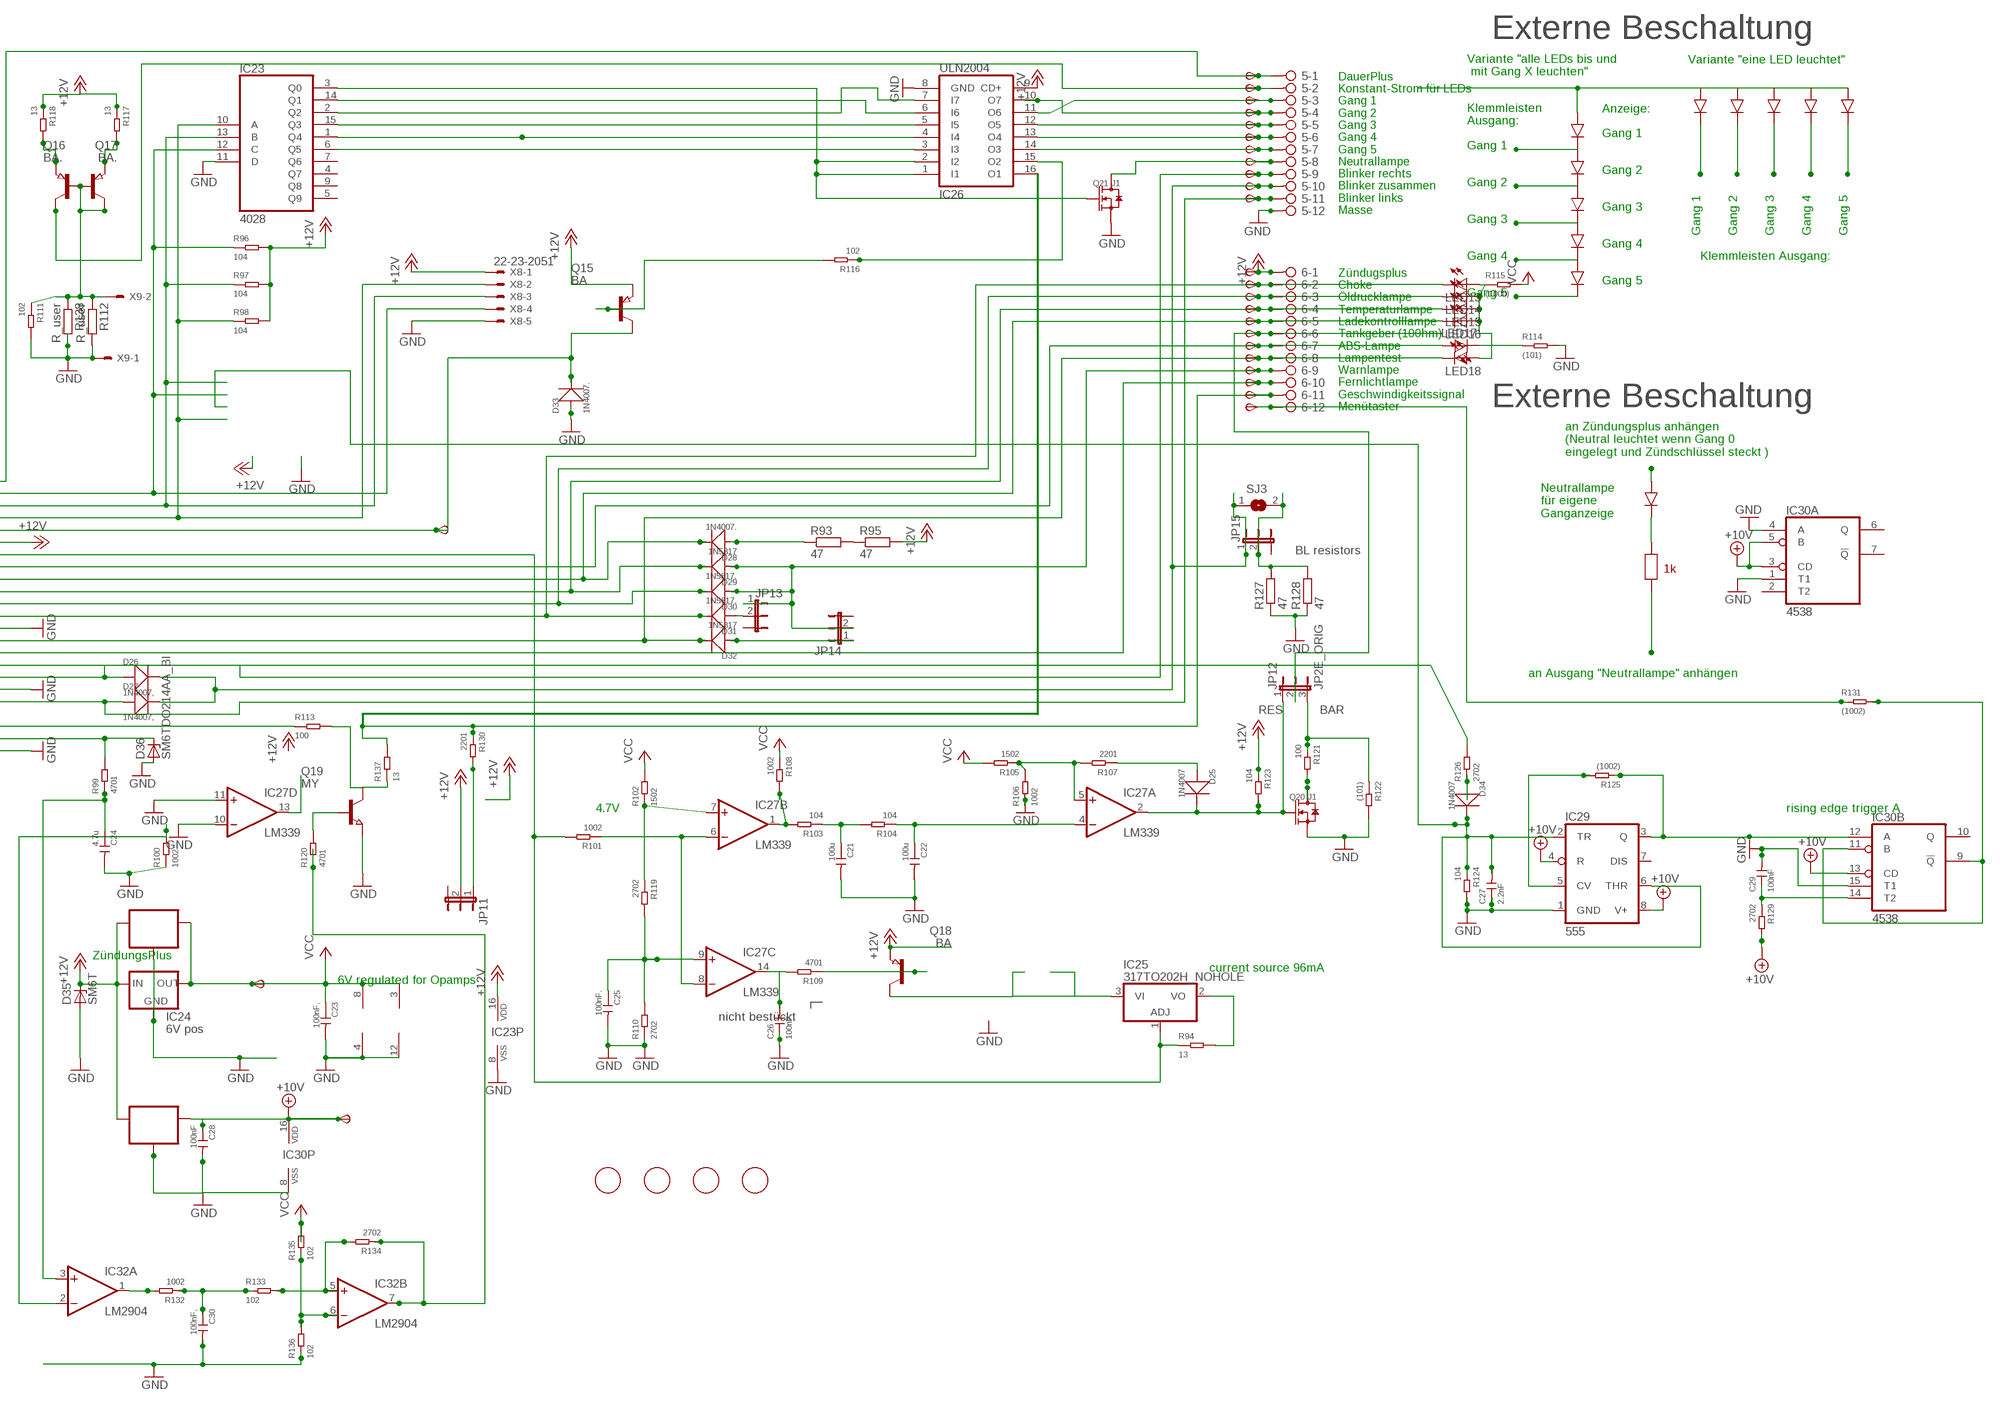
[diagram p5: schematic, sheet 3, part 2 of 2]

### Parts
5  2081-1132  [12-PIN]
6  2081-1132  [12-PIN]
6V2  TPSB2.0  [B2.0]
10V2  TPSB2.0  [B2.0]
C21  100u  CERAMIC-100UF-6.3V-20%-X5R(1206)  [C1206]
C22  100u  CERAMIC-100UF-6.3V-20%-X5R(1206)  [C1206]
C23  100nF,  CERAMIC-100NF-50V-10%-X7R(0805)  [C0805]
C24  4.7u  CERAMIC-4.7UF-25V-10%-X5R(0805)  [C0805]
C25  100nF.  CERAMIC-100NF-50V-10%-X7R(0805)  [C0805]
C26  100nF.  CERAMIC-100NF-50V-10%-X7R(0805)  [C0805]
C27  2.2nF  CERAMIC-100NF-50V-10%-X7R(0805)  [C0805]
C28  100nF  CERAMIC-100NF-50V-10%-X7R(0805)  [C0805]
C29  100nF  CERAMIC-100NF-50V-10%-X7R(0805)  [C0805]
C30  100nF,  CERAMIC-100NF-50V-10%-X7R(0805)  [C0805]
D25  1N4007  DIODE-GEN-PURPOSE-1KV-1A(DO-214AC)  [DO-214AC]
D26  1N4007,  DIODE-GEN-PURPOSE-1KV-1A(DO-214AC)  [DO-214AC]
D27  1N4007,  DIODE-GEN-PURPOSE-1KV-1A(DO-214AC)  [DO-214AC]
D28  1N4007.  DIODE-GEN-PURPOSE-1KV-1A(DO-214AC)  [DO-214AC]
D29  1N5817  DIODE-GEN-PURPOSE-1KV-1A(DO-214AC)DO-214AC/1206  [DO-214AC_SLIM]
D30  1N5817.  DIODE-GEN-PURPOSE-1KV-1A(DO-214AC)DO-214AC/1206  [DO-214AC_SLIM]
D31  1N5817.  DIODE-GEN-PURPOSE-1KV-1A(DO-214AC)DO-214AC/1206  [DO-214AC_SLIM]
D32  1N5817  DIODE-GEN-PURPOSE-1KV-1A(DO-214AC)DO-214AC/1206  [DO-214AC_SLIM]
D33  1N4007.  DIODE-GEN-PURPOSE-1KV-1A(DO-214AC)  [DO-214AC]
D34  1N4007  DIODE-GEN-PURPOSE-1KV-1A(DO-214AC)  [DO-214AC]
D35  SM6T  [DO214AA]
D36  SM6TDO214AA_BI  [DO214AA_BI]
FID9  FIDUCIAL  [FIDUCIAL_1MM]
FID10  FIDUCIAL  [FIDUCIAL_1MM]
FID11  FIDUCIAL  [FIDUCIAL_1MM]
FID12  FIDUCIAL  [FIDUCIAL_1MM]
IC23  4028  4028D  [SO16]
IC24  6V pos  78LXX  [78LXX]
IC25  317TO202H_NOHOLE  [TO220H_NOHOLE]
IC26  ULN2004  ULN2004AD  [SO16]
IC27  LM339  LM339D  [SO14]
IC28  78L06  78LXXSOT89_ROUND  [SOT89_ROUND]
IC29  555  NE555D  [SO08]
IC30  4538  4538D  [SO16]
IC31  78L10  78LXXSOT89_ROUND  [SOT89_ROUND]
IC32  LM2904  LM358D  [SO08]
JP11  JP2EJP2_SMALLPADS  [JP2_SMALLPADS]
JP12  JP2E_ORIG  [JP2_ORIG_SMALLPADS]
JP13  JP2EJP2_SMALLPADS  [JP2_SMALLPADS]
JP14  JP2EJP2_SMALLPADS  [JP2_SMALLPADS]
JP15  JP2EJP2_SMALLPADS  [JP2_SMALLPADS]
LED13  LEDLD260  [LD260]
LED14  LEDLD260  [LD260]
LED15  LEDLD260  [LD260]
LED16  LEDLD260  [LD260]
LED17  LEDLD260  [LD260]
LED18  LEDLD260  [LD260]
Q15  BA  PNP-TRANSISTOR_SOT89  [SOT89]
Q16  BA.  PNP-TRANSISTOR_SOT89  [SOT89]
Q17  BA.  PNP-TRANSISTOR_SOT89  [SOT89]
Q18  BA  PNP-TRANSISTOR_SOT89  [SOT89]
Q19  MY  NPN-TRANSISTOR_SOT89  [SOT89]
Q20  J1  SMD-MOSFET-N-CH-50V-200MA-BSS138W-7-F(SOT-23)  [SOT-23]
Q21  J1  SMD-MOSFET-N-CH-50V-200MA-BSS138W-7-F(SOT-23)  [SOT-23]
R93  47  R-EU_V235/17_1MM  [V235/17_1MM]
R94  13  SMD-RES-13R-5%-1/4W(1206)  [R1206]
R95  47  R-EU_V235/17_1MM  [V235/17_1MM]
R96  104  SMD-RES-10K-1%-1/8W(0805)  [R0805]
R97  104  SMD-RES-10K-1%-1/8W(0805)  [R0805]
R98  104  SMD-RES-10K-1%-1/8W(0805)  [R0805]
R99  4701  SMD-RES-4.7K-5%-1/8W(0805)  [R0805]
R100  1002  SMD-RES-10K-1%-1/8W(0805)  [R0805]
R101  1002  SMD-RES-10K-1%-1/8W(0805)  [R0805]
R102  1502  SMD-RES-10K-1%-1/8W(0805)  [R0805]
R103  104  SMD-RES-10K-1%-1/8W(0805)  [R0805]
R104  104  SMD-RES-10K-1%-1/8W(0805)  [R0805]
R105  1502  SMD-RES-10K-1%-1/8W(0805)  [R0805]
R106  1002  SMD-RES-10K-1%-1/8W(0805)  [R0805]
R107  2201  SMD-RES-2.2K-5%-1/8W(0805)  [R0805]
R108  1002  SMD-RES-10K-1%-1/8W(0805)  [R0805]
R109  4701  SMD-RES-4.7K-5%-1/8W(0805)  [R0805]
R110  2702  SMD-RES-4.7K-5%-1/8W(0805)  [R0805]
R111  102  SMD-RES-1K-5%-1/8W(0805)  [R0805]
R112  R_user  R-EU_R0805  [R0805]
R113  100  SMD-RES-220R-5%-1/8W(0805)  [R0805]
R114  (101)  SMD-RES-100R-5%-1/8W(0805)  [R0805]
R115  (1000)  SMD-RES-100R-5%-1/8W(0805)  [R0805]
R116  102  SMD-RES-1K-5%-1/8W(0805)  [R0805]
R117  13  SMD-RES-13R-5%-1/4W(1206)  [R1206]
R118  13  SMD-RES-13R-5%-1/4W(1206)  [R1206]
R119  2702  SMD-RES-4.7K-5%-1/8W(0805)  [R0805]
R120  4701  SMD-RES-4.7K-5%-1/8W(0805)  [R0805]
R121  100  SMD-RES-2.2K-5%-1/8W(0805)  [R0805]
R122  (101)  SMD-RES-2.2K-5%-1/8W(0805)  [R0805]
R123  104  SMD-RES-10K-1%-1/8W(0805)  [R0805]
R124  104  SMD-RES-10K-1%-1/8W(0805)  [R0805]
R125  (1002)  SMD-RES-10K-1%-1/8W(0805)  [R0805]
R126  2702  SMD-RES-10K-1%-1/8W(0805)  [R0805]
R127  47  R-EU_V235/17_1MM  [V235/17_1MM]
R128  47  R-EU_V235/17_1MM  [V235/17_1MM]
R129  2702  SMD-RES-4.7K-5%-1/8W(0805)  [R0805]
R130  2201  SMD-RES-2.2K-5%-1/8W(0805)  [R0805]
R131  (1002)  SMD-RES-4.7K-5%-1/8W(0805)  [R0805]
R132  1002  SMD-RES-10K-1%-1/8W(0805)  [R0805]
R133  102  SMD-RES-1K-5%-1/8W(0805)  [R0805]
R134  2702  SMD-RES-4.7K-5%-1/8W(0805)  [R0805]
R135  102  SMD-RES-1K-5%-1/8W(0805)  [R0805]
R136  102  SMD-RES-1K-5%-1/8W(0805)  [R0805]
R137  13  SMD-RES-13R-5%-1/4W(1206)  [R1206]
R138  R_user  R-EU_R0805  [R0805]
SJ3  SJ  [SJ]
START2  TPSB2.0  [B2.0]
TP47  TPSB2.0  [B2.0]
TP48  TPSB2.0  [B2.0]
TP49  TPSB2.0  [B2.0]
TP50  TPSB2.0  [B2.0]
TP51  TPSB2.0  [B2.0]
TP52  TPSB2.0  [B2.0]
TP53  TPSB2.0  [B2.0]
TP54  TPSB2.0  [B2.0]
TP55  TPSB2.0  [B2.0]
TP56  TPSB2.0  [B2.0]
TP57  TPSB2.0  [B2.0]
TP58  TPSB2.0  [B2.0]
TP59  TPSB2.0  [B2.0]
TP60  TPSB2.0  [B2.0]
TP61  TPSB2.0  [B2.0]
TP62  TPSB2.0  [B2.0]
TP63  TPSB2.0  [B2.0]
TP64  TPSB2.0  [B2.0]
TP65  TPSB1,27  [B1,27]
TP66  TPSB2.0  [B2.0]
TP67  TPSB2.0  [B2.0]
TP68  TPSB2.0  [B2.0]
TP69  TPSB2.0  [B2.0]
X7  CON_BMWV2  [24-PIN_V2]
X8  22-23-2051  [22-23-2051]
X9  22-23-2021  [22-23-2021]

### Nets
+10V: 10V2.TP(PP) C28.1 IC29.4(R) IC29.8(V+) IC30.3(A:CD) IC30.5(A:B) IC30.13(B:CD) IC30.16(P:VDD) IC31.1(OUT) R129.2 ; also sheet 1,2,4,5,6,7,8,9,10,11,12
+12V: 6.1 D35.C IC23.16(VDD) IC24.IN IC26.9(CD+) IC28.3(IN) IC31.3(IN) JP11.2 Q15.3(E) Q18.3(E) R95.2 R96.2 R97.2 R98.2 R117.1 R118.1 R123.1 TP68.TP(PP) X7.6 X8.1 ; also sheet 1,2,4,5,6,7,8,9,10,11,12
+12V3: IC32.7(B:OUT) R120.1 R134.1
GND: 5.12 C21.2 C22.2 C23.2 C24.2 C25.2 C26.1 C27.1 C28.2 C29.2 C30.2 D33.1(+) D35.A D36.A IC23.8(VSS) IC23.11(D) IC24.GND IC26.8(GND) IC27.10(D:-IN) IC27.11(D:+IN) IC27.12(P:GND) IC28.2(GND) IC28.2@1(GND) IC29.1(GND) IC30.1(A:T1) IC30.4(A:A) IC30.8(P:VSS) IC30.15(B:T1) IC31.2(GND) IC31.2@1(GND) IC32.4(P:V-) Q19.3(E) Q20.2(S) Q21.2(S) R100.1 R106.1 R110.1 R111.2 R112.2 R114.2 R122.2 R124.2 R127.1 R128.1 R136.1 R138.2 X7.13 X7.18 X7.23 X8.5 X9.1 ; also sheet 1,2,4,5,6,7,8,9,10,11,12
N$198: R93.2 R95.1
N$199: 6.9 D29.1(+) D30.1(+) JP13.1 JP14.2 TP65.TP(PP)
N$200: IC23.10(A) R98.1 X7.4 X8.2
N$201: IC23.13(B) R97.1 X7.3 X8.3
N$202: D33.2(-) Q15.2(C) START2.TP(PP) X7.5
N$203: IC23.12(C) R96.1 X7.2 X8.4
N$204: 6.7 LED17.A TP63.TP(PP) X7.8
N$205: 6.2 D31.2(-) LED13.K(C) TP58.TP(PP) X7.12
N$206: 6.3 D30.2(-) LED14.K(C) TP59.TP(PP) X7.11
N$207: 6.4 D29.2(-) LED15.K(C) TP60.TP(PP) X7.10
N$208: 6.8 D32.2(-) LED18.K(C) TP64.TP(PP) X7.14
N$209: 5.9 D26.1(+) TP55.TP(PP) X7.17
N$210: 5.11 D27.1(+) TP57.TP(PP) X7.19
N$211: D36.C R99.2 X7.22
N$212: C24.1 IC32.3(A:+IN) R99.1
N$213: 6.11 IC26.16(O1) R130.1 R137.2 TP67.TP(PP)
N$214: IC27.1(B:OUT) R103.2 R108.2
N$215: C21.1 R103.1 R104.2
N$216: C22.1 IC27.4(A:-IN) R104.1
N$217: IC27.5(A:+IN) R105.1 R106.2 R107.2
N$218: D25.1(+) R107.1
N$219: C25.1 IC27.9(C:+IN) R110.2 R119.2
N$220: C26.2 IC27.14(C:OUT) R109.2
N$221: Q18.1(B) R109.1
N$222: IC23.2(Q2) IC26.7(I7)
N$223: 5.5 IC26.12(O5) TP51.TP(PP)
N$224: IC23.1(Q4) IC26.4(I4)
N$225: 5.8 Q21.3(D) TP54.TP(PP)
N$226: 6.10 TP66.TP(PP) X7.15
N$227: 6.5 D28.2(-) LED16.K(C) TP61.TP(PP) X7.9
N$228: D28.1(+) R93.1
N$229: IC23.6(Q5) IC26.3(I3)
N$230: 5.4 IC26.10(O7) TP50.TP(PP)
N$231: IC25.1(ADJ) R94.1 R101.2 X7.7
N$232: IC27.6(B:-IN) IC27.8(C:-IN) R101.1
N$233: 5.2 Q17.2(C) TP48.TP(PP)
N$234: 5.1 TP47.TP(PP) X7.1
N$248: R126.2 X7.16
N$249: IC23.15(Q3) IC26.5(I5)
N$250: 5.6 IC26.13(O4) TP52.TP(PP)
N$251: 5.7 IC26.14(O3) TP53.TP(PP)
N$252: 6.6 JP12.2 TP62.TP(PP)
N$253: LED17.K(C) R114.1
N$254: LED13.A LED14.A LED15.A LED16.A LED18.A R115.1
N$255: Q15.1(B) R116.2
N$256: IC23.3(Q0) IC26.1(I1) IC26.2(I2) Q21.1(G)
N$257: IC23.14(Q1) IC26.6(I6)
N$258: 5.3 IC26.11(O6) TP49.TP(PP)
N$259: Q16.1(B) Q16.2(C) Q17.1(B) R111.1 R112.1 R138.1 X9.2
N$260: Q17.3(E) R118.2
N$261: Q16.3(E) R117.2
N$262: IC27.7(B:+IN) R102.1 R119.1
N$263: IC32.2(A:-IN) R100.2
N$264: Q19.1(B) R120.2
N$265: Q20.3(D) R121.2
N$266: IC25.2(VO) R94.2
N$267: IC25.3(VI) Q18.2(C)
N$268: C27.2 D34.2(-) IC29.2(TR) IC29.6(THR) R124.1
N$269: IC29.5(CV) R125.2
N$270: IC29.3(Q) IC30.12(B:A) R125.1
N$271: D34.1(+) R126.1
N$272: 5.10 D26.2(-) D27.2(-) JP15.1 SJ3.1 TP56.TP(PP)
N$273: JP15.2 R127.2 R128.2 SJ3.2
N$274: IC30.9(B:!Q) IC30.11(B:B) R131.2
N$275: C29.1 IC30.14(B:T2) R129.1
N$276: JP11.1 R130.2
N$277: IC26.15(O2) R116.1
N$278: 6.12 R131.1 TP69.TP(PP)
N$279: D31.1(+) JP13.2
N$280: D25.2(-) IC27.2(A:OUT) JP12.1 Q20.1(G) R123.2
N$281: IC32.1(A:OUT) R132.2
N$282: C30.1 R132.1 R133.1
N$283: IC32.5(B:+IN) R133.2 R134.2
N$284: IC32.6(B:-IN) R135.1 R136.2
N$285: D32.1(+) JP14.1
N$286: JP12.3 R121.1 R122.1
N$287: IC27.13(D:OUT)
N$288: R113.1 X7.21
N$289: Q19.2(C) R113.2 R137.1
VCC: 6V2.TP(PP) C23.1 IC24.OUT IC27.3(P:V+) IC28.1(OUT) IC32.8(P:V+) R102.2 R105.2 R108.1 R115.2 R135.2 ; also sheet 1,2,4,5,6,7,8,9,10,11,12
Unconnected: IC23.4(Q7) IC23.5(Q9) IC23.7(Q6) IC23.9(Q8) IC29.7(DIS) IC30.2(A:T2) IC30.6(A:Q) IC30.7(A:!Q) IC30.10(B:Q) X7.20 X7.24

### Notes on the sheet
- Externe Beschaltung
- Variante "eine LED leuchtet"
- Variante "alle LEDs bis und
   mit Gang X leuchten"
- Anzeige:
- Klemmleisten
  Ausgang:
- Gang 1
- DauerPlus
  Konstant-Strom für LEDs
  Gang 1
  Gang 2
  Gang 3
  Gang 4
  Gang 5
  Neutrallampe
  Blinker rechts
  Blinker zusammen
  Blinker links
  Masse
- Gang 1
- Gang 2
- Gang 2
- Gang 3
- Gang 3
- Gang 1 | Gang 2 | Gang 3 | Gang 4 | Gang 5
- Gang 4
- Gang 4 | Klemmleisten Ausgang:
- Gang 5
- Gang 5
- Zündugsplus
  Choke
  Öldrucklampe
  Temperaturlampe
  Ladekontrolllampe
  Tankgeber (100hm)
  ABS-Lampe
  Lampentest
  Warnlampe
  Fernlichtlampe
  Geschwindigkeitssignal
  Menütaster
- Stromquelle für Gang
  LEDs. Für mehr als 12mA
  muss ein Widerstand "R_user"
  eingelötet werden. Für weniger
  muss der 1kOhm SMD Widerstand
  neben R_user entfernt werden
  I = 12V/1kOhm(default)+12V/R_user
  I= 12mA (default) + 12V/R_user
  Beispiel:
  R_user      Strom in LEDs
  1 kOhm     22-26mA
  ohne       11-13mA
- Externe Beschaltung
- an Zündungsplus anhängen
  (Neutral leuchtet wenn Gang 0
  eingelegt und Zündschlüssel steckt )
- Neutrallampe
  für eigene
  Ganganzeige
- DauerPlus Batterie 12V (rot weiss)
  Ganganzeige Signal C (gelb weiss)
  Ganganzeige Signal B (gelb schwarz)
  Ganganzeige Signal A (gelb dunkelblau)
  12V/350mA zum Starknopf (schwarz grün)
  Zündungsplus 12V (grün schwarz)
  Reservelampe (weiss)
  ABS Leuchte (blau)
  Ladekontrollleuchte (schaltet auf Masse) (violett schwarz)
  Temperaturleuchte (schaltet auf Masse) (braun schwarz)
  Öldruckleuchte (schaltet auf Masse) (braun grün)
  Chokelampe (schaltet auf Masse) (violett weiss)
- BL resistors
- 1k
- an Ausgang "Neutrallampe" anhängen
- Masse (braun)
  Lampentest (schaltet auf Masse)(weiss blau)
  Fernlichtlampe (12V) (weiss)
  Drehzahl Zündspule (schwarz blau)
  Blinker rechts (blau scharz)
  Masse (braun)
  Blinker links (blau rot)
  nicht angeschlossen
  Tachosiganl zum Blinrelais (balu grün)
  Tachogeber (gelb)
  Masse Tachobeger (braun)
  Tachobeleuchtung (12V Zündungsplus) (grau blau)
- RES | BAR
- 4.7V | rising edge trigger A
- ZündungsPlus
- current source 96mA
- 6V regulated for Opamps
- nicht bestückt

## Sheet 4 of 12
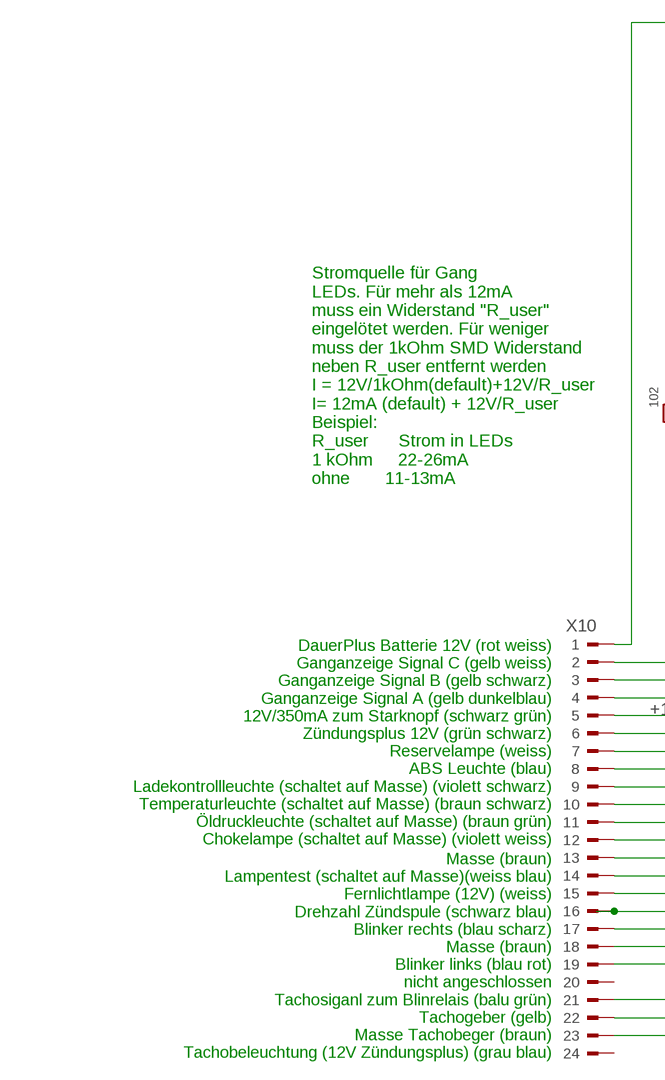
[diagram p6: schematic, sheet 4, part 1 of 2]
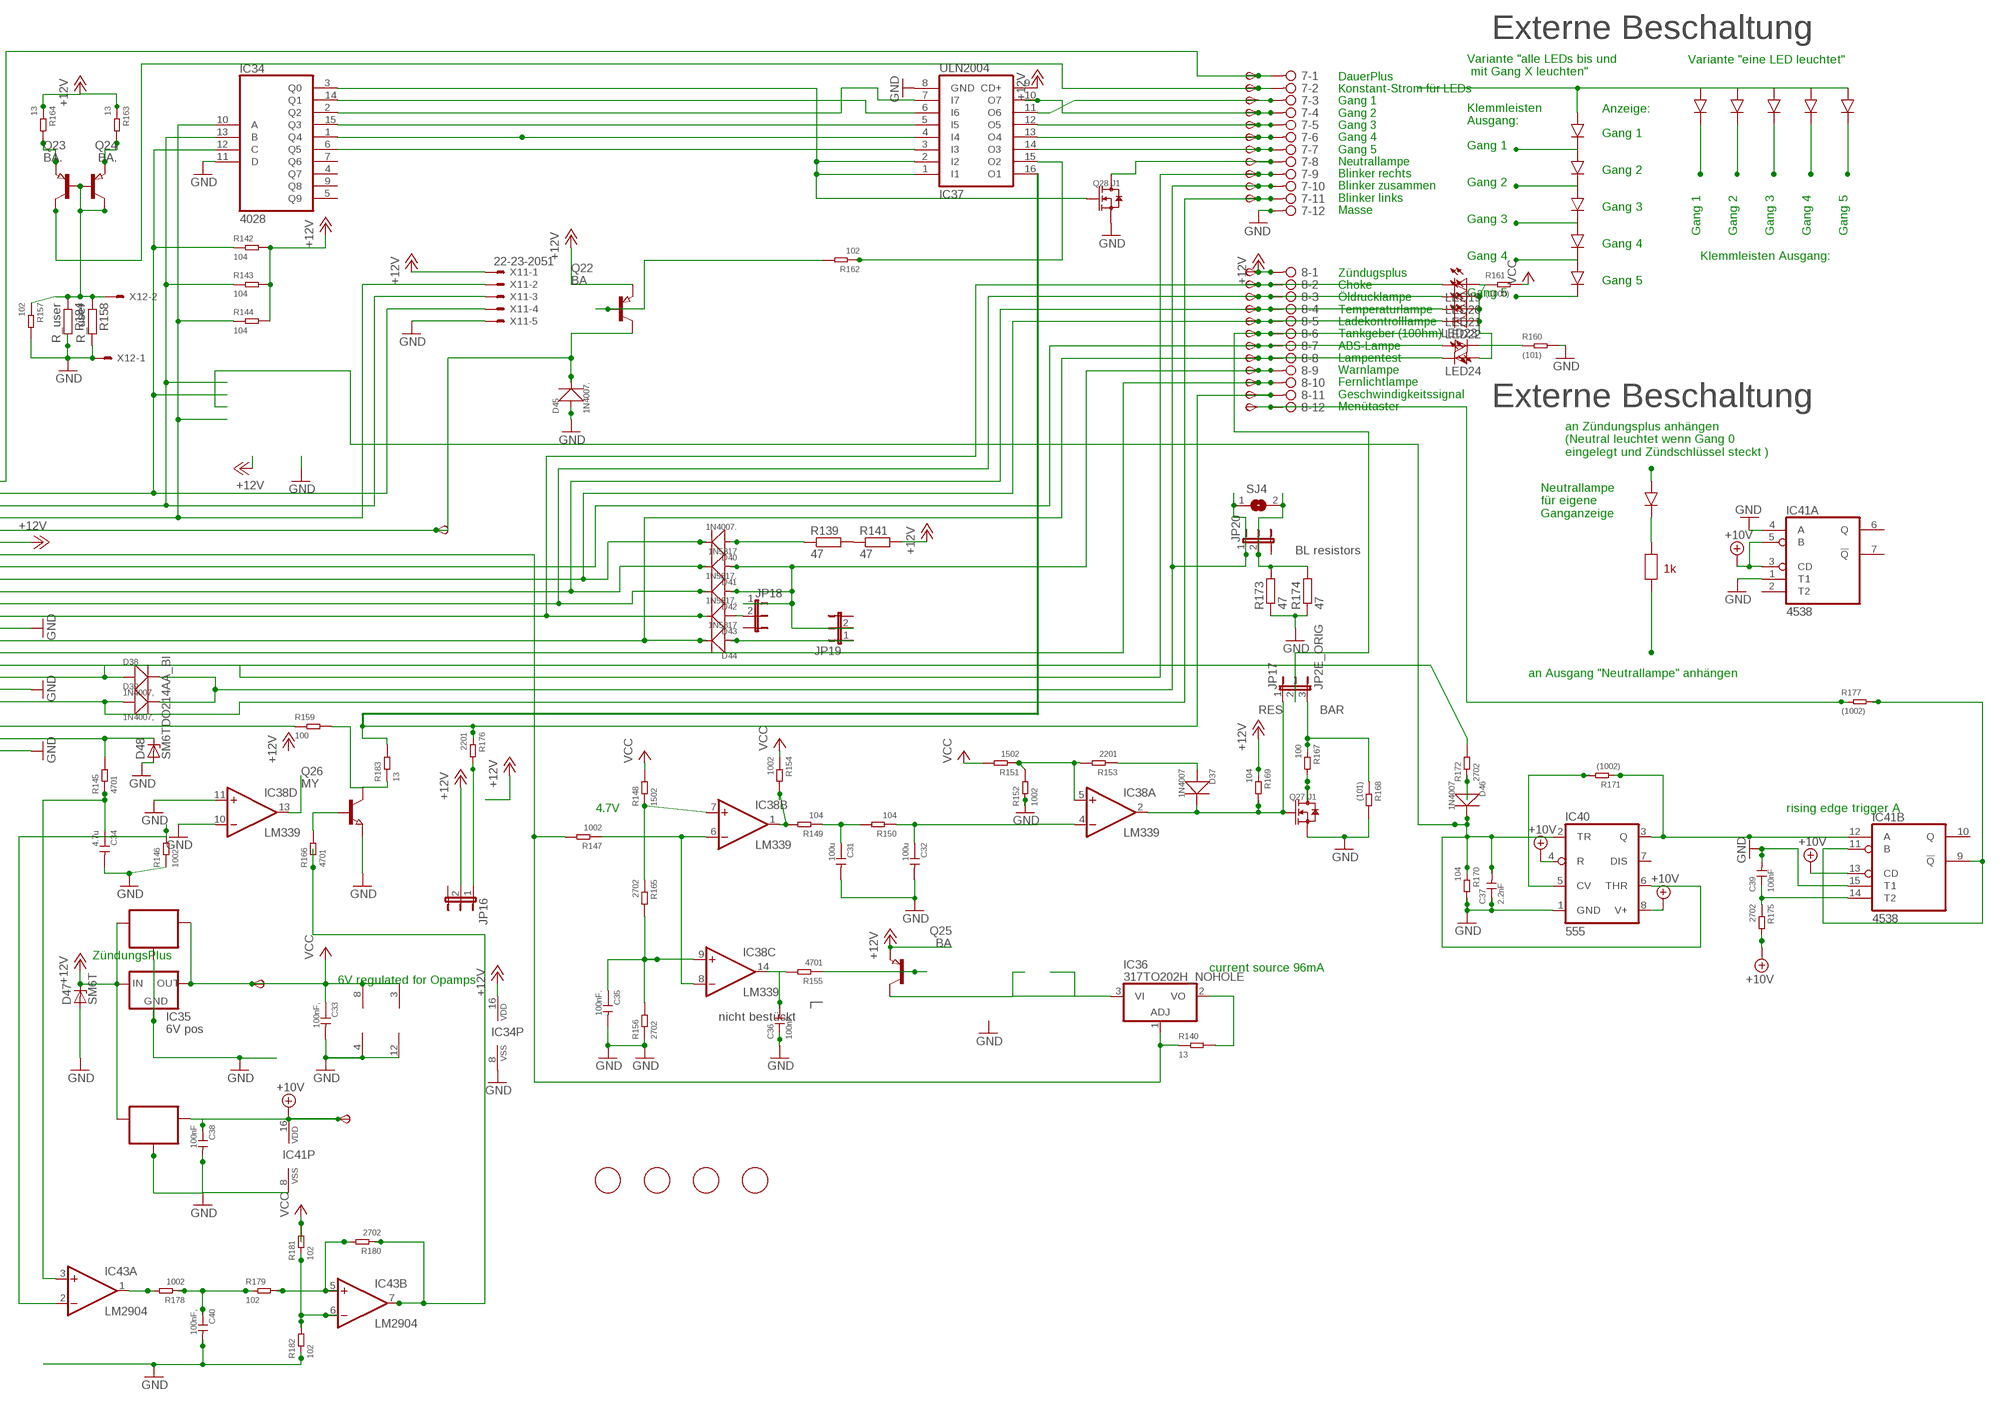
[diagram p7: schematic, sheet 4, part 2 of 2]

### Parts
6V3  TPSB2.0  [B2.0]
7  2081-1132  [12-PIN]
8  2081-1132  [12-PIN]
10V3  TPSB2.0  [B2.0]
C31  100u  CERAMIC-100UF-6.3V-20%-X5R(1206)  [C1206]
C32  100u  CERAMIC-100UF-6.3V-20%-X5R(1206)  [C1206]
C33  100nF,  CERAMIC-100NF-50V-10%-X7R(0805)  [C0805]
C34  4.7u  CERAMIC-4.7UF-25V-10%-X5R(0805)  [C0805]
C35  100nF.  CERAMIC-100NF-50V-10%-X7R(0805)  [C0805]
C36  100nF.  CERAMIC-100NF-50V-10%-X7R(0805)  [C0805]
C37  2.2nF  CERAMIC-100NF-50V-10%-X7R(0805)  [C0805]
C38  100nF  CERAMIC-100NF-50V-10%-X7R(0805)  [C0805]
C39  100nF  CERAMIC-100NF-50V-10%-X7R(0805)  [C0805]
C40  100nF,  CERAMIC-100NF-50V-10%-X7R(0805)  [C0805]
D37  1N4007  DIODE-GEN-PURPOSE-1KV-1A(DO-214AC)  [DO-214AC]
D38  1N4007,  DIODE-GEN-PURPOSE-1KV-1A(DO-214AC)  [DO-214AC]
D39  1N4007,  DIODE-GEN-PURPOSE-1KV-1A(DO-214AC)  [DO-214AC]
D40  1N4007.  DIODE-GEN-PURPOSE-1KV-1A(DO-214AC)  [DO-214AC]
D41  1N5817  DIODE-GEN-PURPOSE-1KV-1A(DO-214AC)DO-214AC/1206  [DO-214AC_SLIM]
D42  1N5817.  DIODE-GEN-PURPOSE-1KV-1A(DO-214AC)DO-214AC/1206  [DO-214AC_SLIM]
D43  1N5817.  DIODE-GEN-PURPOSE-1KV-1A(DO-214AC)DO-214AC/1206  [DO-214AC_SLIM]
D44  1N5817  DIODE-GEN-PURPOSE-1KV-1A(DO-214AC)DO-214AC/1206  [DO-214AC_SLIM]
D45  1N4007.  DIODE-GEN-PURPOSE-1KV-1A(DO-214AC)  [DO-214AC]
D46  1N4007  DIODE-GEN-PURPOSE-1KV-1A(DO-214AC)  [DO-214AC]
D47  SM6T  [DO214AA]
D48  SM6TDO214AA_BI  [DO214AA_BI]
FID13  FIDUCIAL  [FIDUCIAL_1MM]
FID14  FIDUCIAL  [FIDUCIAL_1MM]
FID15  FIDUCIAL  [FIDUCIAL_1MM]
FID16  FIDUCIAL  [FIDUCIAL_1MM]
IC34  4028  4028D  [SO16]
IC35  6V pos  78LXX  [78LXX]
IC36  317TO202H_NOHOLE  [TO220H_NOHOLE]
IC37  ULN2004  ULN2004AD  [SO16]
IC38  LM339  LM339D  [SO14]
IC39  78L06  78LXXSOT89_ROUND  [SOT89_ROUND]
IC40  555  NE555D  [SO08]
IC41  4538  4538D  [SO16]
IC42  78L10  78LXXSOT89_ROUND  [SOT89_ROUND]
IC43  LM2904  LM358D  [SO08]
JP16  JP2EJP2_SMALLPADS  [JP2_SMALLPADS]
JP17  JP2E_ORIG  [JP2_ORIG_SMALLPADS]
JP18  JP2EJP2_SMALLPADS  [JP2_SMALLPADS]
JP19  JP2EJP2_SMALLPADS  [JP2_SMALLPADS]
JP20  JP2EJP2_SMALLPADS  [JP2_SMALLPADS]
LED19  LEDLD260  [LD260]
LED20  LEDLD260  [LD260]
LED21  LEDLD260  [LD260]
LED22  LEDLD260  [LD260]
LED23  LEDLD260  [LD260]
LED24  LEDLD260  [LD260]
Q22  BA  PNP-TRANSISTOR_SOT89  [SOT89]
Q23  BA.  PNP-TRANSISTOR_SOT89  [SOT89]
Q24  BA.  PNP-TRANSISTOR_SOT89  [SOT89]
Q25  BA  PNP-TRANSISTOR_SOT89  [SOT89]
Q26  MY  NPN-TRANSISTOR_SOT89  [SOT89]
Q27  J1  SMD-MOSFET-N-CH-50V-200MA-BSS138W-7-F(SOT-23)  [SOT-23]
Q28  J1  SMD-MOSFET-N-CH-50V-200MA-BSS138W-7-F(SOT-23)  [SOT-23]
R139  47  R-EU_V235/17_1MM  [V235/17_1MM]
R140  13  SMD-RES-13R-5%-1/4W(1206)  [R1206]
R141  47  R-EU_V235/17_1MM  [V235/17_1MM]
R142  104  SMD-RES-10K-1%-1/8W(0805)  [R0805]
R143  104  SMD-RES-10K-1%-1/8W(0805)  [R0805]
R144  104  SMD-RES-10K-1%-1/8W(0805)  [R0805]
R145  4701  SMD-RES-4.7K-5%-1/8W(0805)  [R0805]
R146  1002  SMD-RES-10K-1%-1/8W(0805)  [R0805]
R147  1002  SMD-RES-10K-1%-1/8W(0805)  [R0805]
R148  1502  SMD-RES-10K-1%-1/8W(0805)  [R0805]
R149  104  SMD-RES-10K-1%-1/8W(0805)  [R0805]
R150  104  SMD-RES-10K-1%-1/8W(0805)  [R0805]
R151  1502  SMD-RES-10K-1%-1/8W(0805)  [R0805]
R152  1002  SMD-RES-10K-1%-1/8W(0805)  [R0805]
R153  2201  SMD-RES-2.2K-5%-1/8W(0805)  [R0805]
R154  1002  SMD-RES-10K-1%-1/8W(0805)  [R0805]
R155  4701  SMD-RES-4.7K-5%-1/8W(0805)  [R0805]
R156  2702  SMD-RES-4.7K-5%-1/8W(0805)  [R0805]
R157  102  SMD-RES-1K-5%-1/8W(0805)  [R0805]
R158  R_user  R-EU_R0805  [R0805]
R159  100  SMD-RES-220R-5%-1/8W(0805)  [R0805]
R160  (101)  SMD-RES-100R-5%-1/8W(0805)  [R0805]
R161  (1000)  SMD-RES-100R-5%-1/8W(0805)  [R0805]
R162  102  SMD-RES-1K-5%-1/8W(0805)  [R0805]
R163  13  SMD-RES-13R-5%-1/4W(1206)  [R1206]
R164  13  SMD-RES-13R-5%-1/4W(1206)  [R1206]
R165  2702  SMD-RES-4.7K-5%-1/8W(0805)  [R0805]
R166  4701  SMD-RES-4.7K-5%-1/8W(0805)  [R0805]
R167  100  SMD-RES-2.2K-5%-1/8W(0805)  [R0805]
R168  (101)  SMD-RES-2.2K-5%-1/8W(0805)  [R0805]
R169  104  SMD-RES-10K-1%-1/8W(0805)  [R0805]
R170  104  SMD-RES-10K-1%-1/8W(0805)  [R0805]
R171  (1002)  SMD-RES-10K-1%-1/8W(0805)  [R0805]
R172  2702  SMD-RES-10K-1%-1/8W(0805)  [R0805]
R173  47  R-EU_V235/17_1MM  [V235/17_1MM]
R174  47  R-EU_V235/17_1MM  [V235/17_1MM]
R175  2702  SMD-RES-4.7K-5%-1/8W(0805)  [R0805]
R176  2201  SMD-RES-2.2K-5%-1/8W(0805)  [R0805]
R177  (1002)  SMD-RES-4.7K-5%-1/8W(0805)  [R0805]
R178  1002  SMD-RES-10K-1%-1/8W(0805)  [R0805]
R179  102  SMD-RES-1K-5%-1/8W(0805)  [R0805]
R180  2702  SMD-RES-4.7K-5%-1/8W(0805)  [R0805]
R181  102  SMD-RES-1K-5%-1/8W(0805)  [R0805]
R182  102  SMD-RES-1K-5%-1/8W(0805)  [R0805]
R183  13  SMD-RES-13R-5%-1/4W(1206)  [R1206]
R184  R_user  R-EU_R0805  [R0805]
SJ4  SJ  [SJ]
START3  TPSB2.0  [B2.0]
TP70  TPSB2.0  [B2.0]
TP71  TPSB2.0  [B2.0]
TP72  TPSB2.0  [B2.0]
TP73  TPSB2.0  [B2.0]
TP74  TPSB2.0  [B2.0]
TP75  TPSB2.0  [B2.0]
TP76  TPSB2.0  [B2.0]
TP77  TPSB2.0  [B2.0]
TP78  TPSB2.0  [B2.0]
TP79  TPSB2.0  [B2.0]
TP80  TPSB2.0  [B2.0]
TP81  TPSB2.0  [B2.0]
TP82  TPSB2.0  [B2.0]
TP83  TPSB2.0  [B2.0]
TP84  TPSB2.0  [B2.0]
TP85  TPSB2.0  [B2.0]
TP86  TPSB2.0  [B2.0]
TP87  TPSB2.0  [B2.0]
TP88  TPSB1,27  [B1,27]
TP89  TPSB2.0  [B2.0]
TP90  TPSB2.0  [B2.0]
TP91  TPSB2.0  [B2.0]
TP92  TPSB2.0  [B2.0]
X10  CON_BMWV2  [24-PIN_V2]
X11  22-23-2051  [22-23-2051]
X12  22-23-2021  [22-23-2021]

### Nets
+10V: 10V3.TP(PP) C38.1 IC40.4(R) IC40.8(V+) IC41.3(A:CD) IC41.5(A:B) IC41.13(B:CD) IC41.16(P:VDD) IC42.1(OUT) R175.2 ; also sheet 1,2,3,5,6,7,8,9,10,11,12
+12V: 8.1 D47.C IC34.16(VDD) IC35.IN IC37.9(CD+) IC39.3(IN) IC42.3(IN) JP16.2 Q22.3(E) Q25.3(E) R141.2 R142.2 R143.2 R144.2 R163.1 R164.1 R169.1 TP91.TP(PP) X10.6 X11.1 ; also sheet 1,2,3,5,6,7,8,9,10,11,12
+12V4: IC43.7(B:OUT) R166.1 R180.1
GND: 7.12 C31.2 C32.2 C33.2 C34.2 C35.2 C36.1 C37.1 C38.2 C39.2 C40.2 D45.1(+) D47.A D48.A IC34.8(VSS) IC34.11(D) IC35.GND IC37.8(GND) IC38.10(D:-IN) IC38.11(D:+IN) IC38.12(P:GND) IC39.2(GND) IC39.2@1(GND) IC40.1(GND) IC41.1(A:T1) IC41.4(A:A) IC41.8(P:VSS) IC41.15(B:T1) IC42.2(GND) IC42.2@1(GND) IC43.4(P:V-) Q26.3(E) Q27.2(S) Q28.2(S) R146.1 R152.1 R156.1 R157.2 R158.2 R160.2 R168.2 R170.2 R173.1 R174.1 R182.1 R184.2 X10.13 X10.18 X10.23 X11.5 X12.1 ; also sheet 1,2,3,5,6,7,8,9,10,11,12
N$297: R139.2 R141.1
N$298: 8.9 D41.1(+) D42.1(+) JP18.1 JP19.2 TP88.TP(PP)
N$299: IC34.10(A) R144.1 X10.4 X11.2
N$300: IC34.13(B) R143.1 X10.3 X11.3
N$301: D45.2(-) Q22.2(C) START3.TP(PP) X10.5
N$302: IC34.12(C) R142.1 X10.2 X11.4
N$303: 8.7 LED23.A TP86.TP(PP) X10.8
N$304: 8.2 D43.2(-) LED19.K(C) TP81.TP(PP) X10.12
N$305: 8.3 D42.2(-) LED20.K(C) TP82.TP(PP) X10.11
N$306: 8.4 D41.2(-) LED21.K(C) TP83.TP(PP) X10.10
N$307: 8.8 D44.2(-) LED24.K(C) TP87.TP(PP) X10.14
N$308: 7.9 D38.1(+) TP78.TP(PP) X10.17
N$309: 7.11 D39.1(+) TP80.TP(PP) X10.19
N$310: D48.C R145.2 X10.22
N$311: C34.1 IC43.3(A:+IN) R145.1
N$312: 8.11 IC37.16(O1) R176.1 R183.2 TP90.TP(PP)
N$313: IC38.1(B:OUT) R149.2 R154.2
N$314: C31.1 R149.1 R150.2
N$315: C32.1 IC38.4(A:-IN) R150.1
N$316: IC38.5(A:+IN) R151.1 R152.2 R153.2
N$317: D37.1(+) R153.1
N$318: C35.1 IC38.9(C:+IN) R156.2 R165.2
N$319: C36.2 IC38.14(C:OUT) R155.2
N$320: Q25.1(B) R155.1
N$321: IC34.2(Q2) IC37.7(I7)
N$322: 7.5 IC37.12(O5) TP74.TP(PP)
N$323: IC34.1(Q4) IC37.4(I4)
N$324: 7.8 Q28.3(D) TP77.TP(PP)
N$325: 8.10 TP89.TP(PP) X10.15
N$326: 8.5 D40.2(-) LED22.K(C) TP84.TP(PP) X10.9
N$327: D40.1(+) R139.1
N$328: IC34.6(Q5) IC37.3(I3)
N$329: 7.4 IC37.10(O7) TP73.TP(PP)
N$330: IC36.1(ADJ) R140.1 R147.2 X10.7
N$331: IC38.6(B:-IN) IC38.8(C:-IN) R147.1
N$332: 7.2 Q24.2(C) TP71.TP(PP)
N$333: 7.1 TP70.TP(PP) X10.1
N$347: R172.2 X10.16
N$348: IC34.15(Q3) IC37.5(I5)
N$349: 7.6 IC37.13(O4) TP75.TP(PP)
N$350: 7.7 IC37.14(O3) TP76.TP(PP)
N$351: 8.6 JP17.2 TP85.TP(PP)
N$352: LED23.K(C) R160.1
N$353: LED19.A LED20.A LED21.A LED22.A LED24.A R161.1
N$354: Q22.1(B) R162.2
N$355: IC34.3(Q0) IC37.1(I1) IC37.2(I2) Q28.1(G)
N$356: IC34.14(Q1) IC37.6(I6)
N$357: 7.3 IC37.11(O6) TP72.TP(PP)
N$358: Q23.1(B) Q23.2(C) Q24.1(B) R157.1 R158.1 R184.1 X12.2
N$359: Q24.3(E) R164.2
N$360: Q23.3(E) R163.2
N$361: IC38.7(B:+IN) R148.1 R165.1
N$362: IC43.2(A:-IN) R146.2
N$363: Q26.1(B) R166.2
N$364: Q27.3(D) R167.2
N$365: IC36.2(VO) R140.2
N$366: IC36.3(VI) Q25.2(C)
N$367: C37.2 D46.2(-) IC40.2(TR) IC40.6(THR) R170.1
N$368: IC40.5(CV) R171.2
N$369: IC40.3(Q) IC41.12(B:A) R171.1
N$370: D46.1(+) R172.1
N$371: 7.10 D38.2(-) D39.2(-) JP20.1 SJ4.1 TP79.TP(PP)
N$372: JP20.2 R173.2 R174.2 SJ4.2
N$373: IC41.9(B:!Q) IC41.11(B:B) R177.2
N$374: C39.1 IC41.14(B:T2) R175.1
N$375: JP16.1 R176.2
N$376: IC37.15(O2) R162.1
N$377: 8.12 R177.1 TP92.TP(PP)
N$378: D43.1(+) JP18.2
N$379: D37.2(-) IC38.2(A:OUT) JP17.1 Q27.1(G) R169.2
N$380: IC43.1(A:OUT) R178.2
N$381: C40.1 R178.1 R179.1
N$382: IC43.5(B:+IN) R179.2 R180.2
N$383: IC43.6(B:-IN) R181.1 R182.2
N$384: D44.1(+) JP19.1
N$385: JP17.3 R167.1 R168.1
N$386: IC38.13(D:OUT)
N$387: R159.1 X10.21
N$388: Q26.2(C) R159.2 R183.1
VCC: 6V3.TP(PP) C33.1 IC35.OUT IC38.3(P:V+) IC39.1(OUT) IC43.8(P:V+) R148.2 R151.2 R154.1 R161.2 R181.2 ; also sheet 1,2,3,5,6,7,8,9,10,11,12
Unconnected: IC34.4(Q7) IC34.5(Q9) IC34.7(Q6) IC34.9(Q8) IC40.7(DIS) IC41.2(A:T2) IC41.6(A:Q) IC41.7(A:!Q) IC41.10(B:Q) X10.20 X10.24

### Notes on the sheet
- Externe Beschaltung
- Variante "eine LED leuchtet"
- Variante "alle LEDs bis und
   mit Gang X leuchten"
- Anzeige:
- Klemmleisten
  Ausgang:
- Gang 1
- DauerPlus
  Konstant-Strom für LEDs
  Gang 1
  Gang 2
  Gang 3
  Gang 4
  Gang 5
  Neutrallampe
  Blinker rechts
  Blinker zusammen
  Blinker links
  Masse
- Gang 1
- Gang 2
- Gang 2
- Gang 3
- Gang 3
- Gang 1 | Gang 2 | Gang 3 | Gang 4 | Gang 5
- Gang 4
- Gang 4 | Klemmleisten Ausgang:
- Gang 5
- Gang 5
- Zündugsplus
  Choke
  Öldrucklampe
  Temperaturlampe
  Ladekontrolllampe
  Tankgeber (100hm)
  ABS-Lampe
  Lampentest
  Warnlampe
  Fernlichtlampe
  Geschwindigkeitssignal
  Menütaster
- Stromquelle für Gang
  LEDs. Für mehr als 12mA
  muss ein Widerstand "R_user"
  eingelötet werden. Für weniger
  muss der 1kOhm SMD Widerstand
  neben R_user entfernt werden
  I = 12V/1kOhm(default)+12V/R_user
  I= 12mA (default) + 12V/R_user
  Beispiel:
  R_user      Strom in LEDs
  1 kOhm     22-26mA
  ohne       11-13mA
- Externe Beschaltung
- an Zündungsplus anhängen
  (Neutral leuchtet wenn Gang 0
  eingelegt und Zündschlüssel steckt )
- Neutrallampe
  für eigene
  Ganganzeige
- DauerPlus Batterie 12V (rot weiss)
  Ganganzeige Signal C (gelb weiss)
  Ganganzeige Signal B (gelb schwarz)
  Ganganzeige Signal A (gelb dunkelblau)
  12V/350mA zum Starknopf (schwarz grün)
  Zündungsplus 12V (grün schwarz)
  Reservelampe (weiss)
  ABS Leuchte (blau)
  Ladekontrollleuchte (schaltet auf Masse) (violett schwarz)
  Temperaturleuchte (schaltet auf Masse) (braun schwarz)
  Öldruckleuchte (schaltet auf Masse) (braun grün)
  Chokelampe (schaltet auf Masse) (violett weiss)
- BL resistors
- 1k
- an Ausgang "Neutrallampe" anhängen
- Masse (braun)
  Lampentest (schaltet auf Masse)(weiss blau)
  Fernlichtlampe (12V) (weiss)
  Drehzahl Zündspule (schwarz blau)
  Blinker rechts (blau scharz)
  Masse (braun)
  Blinker links (blau rot)
  nicht angeschlossen
  Tachosiganl zum Blinrelais (balu grün)
  Tachogeber (gelb)
  Masse Tachobeger (braun)
  Tachobeleuchtung (12V Zündungsplus) (grau blau)
- RES | BAR
- 4.7V | rising edge trigger A
- ZündungsPlus
- current source 96mA
- 6V regulated for Opamps
- nicht bestückt